# EAGLE schematic MotherBoard (EAGLE 5.01)

## Sheet 1 of 18
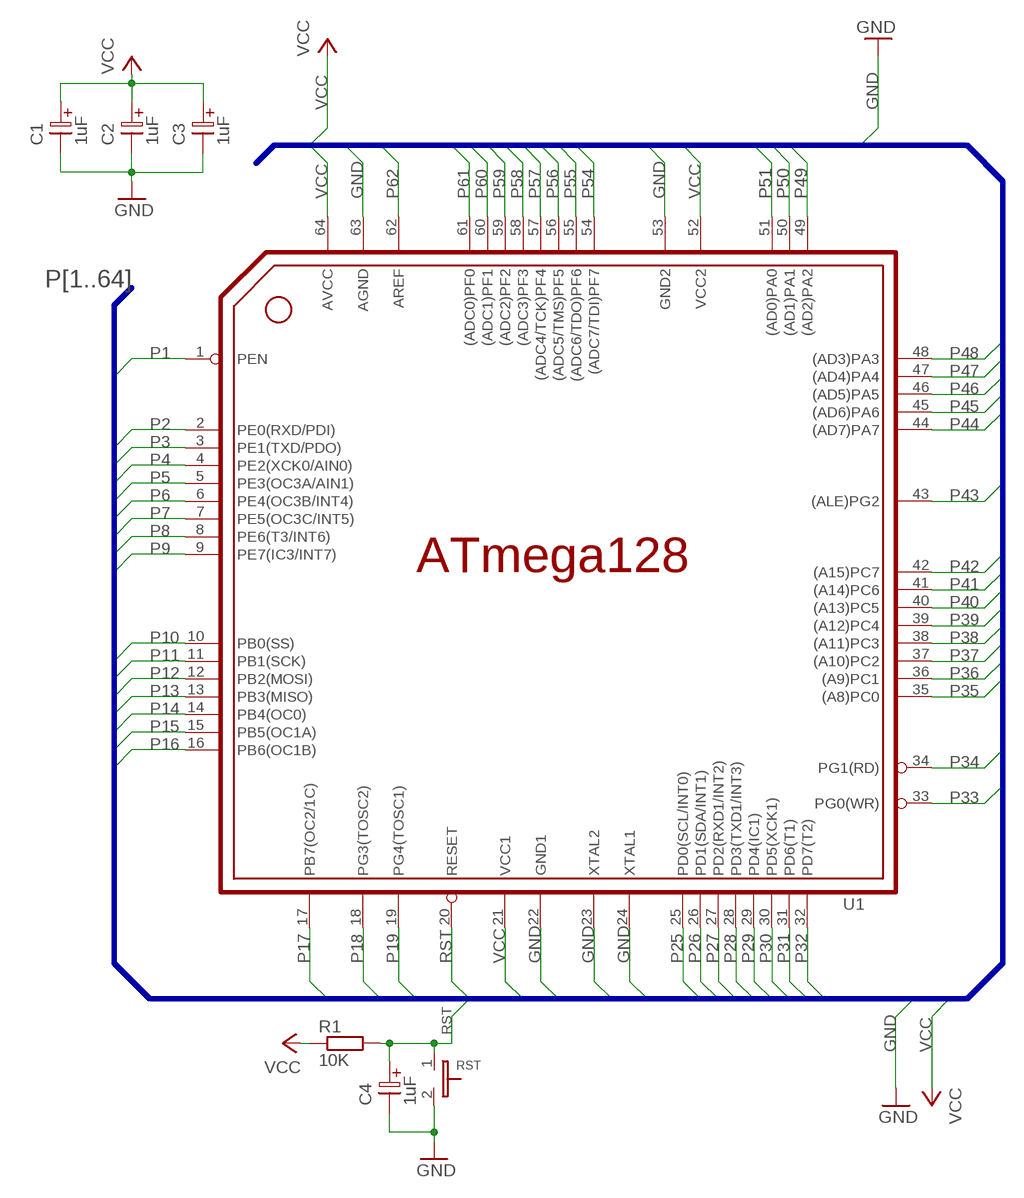
[diagram p0: schematic, sheet 1]

### Parts
C1  1uF  ELC2.5  [ELC2.5]
C2  1uF  ELC2.5  [ELC2.5]
C3  1uF  ELC2.5  [ELC2.5]
C4  1uF  ELC2.5  [ELC2.5]
R1  10K  R-5-10M  [R-10]
RST  TAC_SW_S  [SW]
U1  ATMEGA128_HOLDERH  [HEADER64PIN]

### Nets
GND: C1.2 C2.2 C3.2 C4.2 RST.2 U1.22(GND1) U1.23(XTAL2) U1.24(XTAL1) U1.53(GND2) U1.63(AGND) ; also sheet 2,3,4,5,6,7,8,10,11,12,13,14,15,16,17,18
P1: U1.1(PEN)
P2: U1.2(PE0(RXD/PDI)) ; also sheet 4,6,11,12
P3: U1.3(PE1(TXD/PDO)) ; also sheet 4,6,11,12
P4: U1.4(PE2(XCK0/AIN0)) ; also sheet 4,6,11,12
P5: U1.5(PE3(OC3A/AIN1)) ; also sheet 4,6,12,18
P6: U1.6(PE4(OC3B/INT4)) ; also sheet 4,5,12
P7: U1.7(PE5(OC3C/INT5)) ; also sheet 4,5,12
P8: U1.8(PE6(T3/INT6)) ; also sheet 4,5,12
P9: U1.9(PE7(IC3/INT7)) ; also sheet 4,5,12
P10: U1.10(PB0(SS)) ; also sheet 4,5,16
P11: U1.11(PB1(SCK)) ; also sheet 3,4,5,16
P12: U1.12(PB2(MOSI)) ; also sheet 3,4,5,16
P13: U1.13(PB3(MISO)) ; also sheet 3,4,5,16
P14: U1.14(PB4(OC0)) ; also sheet 4,5,13
P15: U1.15(PB5(OC1A)) ; also sheet 4,5,15
P16: U1.16(PB6(OC1B)) ; also sheet 4,5,18
P17: U1.17(PB7(OC2/1C)) ; also sheet 4,5,15
P18: U1.18(PG3(TOSC2))
P19: U1.19(PG4(TOSC1))
P25: U1.25(PD0(SCL/INT0)) ; also sheet 4,5,8,16
P26: U1.26(PD1(SDA/INT1)) ; also sheet 4,5,8
P27: U1.27(PD2(RXD1/INT2)) ; also sheet 4,5,6,8
P28: U1.28(PD3(TXD1/INT3)) ; also sheet 4,5,6,8
P29: U1.29(PD4(IC1)) ; also sheet 4,18
P30: U1.30(PD5(XCK1)) ; also sheet 4,18
P31: U1.31(PD6(T1)) ; also sheet 4,18
P32: U1.32(PD7(T2)) ; also sheet 4,18
P33: U1.33(PG0(WR)) ; also sheet 10,17
P34: U1.34(PG1(RD)) ; also sheet 10,17
P35: U1.35((A8)PC0) ; also sheet 4,10,13
P36: U1.36((A9)PC1) ; also sheet 4,10
P37: U1.37((A10)PC2) ; also sheet 4,7,10
P38: U1.38((A11)PC3) ; also sheet 4,7,10
P39: U1.39((A12)PC4) ; also sheet 4,7,9,10
P40: U1.40((A13)PC5) ; also sheet 4,7,9,10
P41: U1.41((A14)PC6) ; also sheet 4,7,9,10
P42: U1.42((A15)PC7) ; also sheet 4,7,9,10
P43: U1.43((ALE)PG2) ; also sheet 13,16
P44: U1.44((AD7)PA7) ; also sheet 4,7,9
P45: U1.45((AD6)PA6) ; also sheet 4,7,9
P46: U1.46((AD5)PA5) ; also sheet 4,7,9
P47: U1.47((AD4)PA4) ; also sheet 4,7,9,17
P48: U1.48((AD3)PA3) ; also sheet 4,7,9,17
P49: U1.49((AD2)PA2) ; also sheet 4,7,9,17
P50: U1.50((AD1)PA1) ; also sheet 4,6,7,9
P51: U1.51((AD0)PA0) ; also sheet 4,6,7,9
P54: U1.54((ADC7/TDI)PF7) ; also sheet 4,13
P55: U1.55((ADC6/TDO)PF6) ; also sheet 4,13
P56: U1.56((ADC5/TMS)PF5) ; also sheet 4,13
P57: U1.57((ADC4/TCK)PF4) ; also sheet 4,13
P58: U1.58((ADC3)PF3) ; also sheet 4,13
P59: U1.59((ADC2)PF2) ; also sheet 4,13
P60: U1.60((ADC1)PF1) ; also sheet 4,13
P61: U1.61((ADC0)PF0) ; also sheet 4,13
P62: U1.62(AREF) ; also sheet 13
RST: C4.1 R1.2 RST.1 U1.20(RESET) ; also sheet 3
VCC: C1.1 C2.1 C3.1 R1.1 U1.21(VCC1) U1.52(VCC2) U1.64(AVCC) ; also sheet 2,3,4,5,6,7,8,9,10,11,12,13,14,15,16,17,18

### Buses
P[1..64]

## Sheet 2 of 18
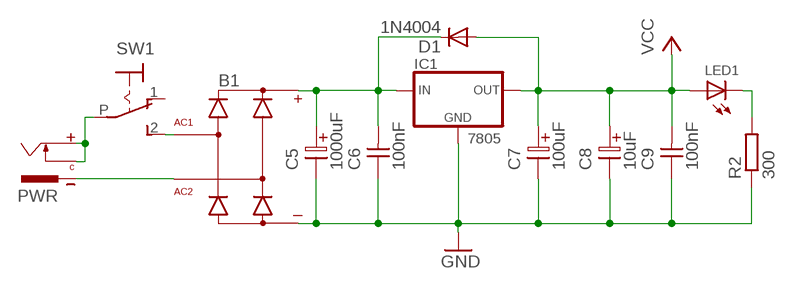
[diagram p1: schematic, sheet 2]

### Parts
B1  RB1A  [RB1A]
C5  1000uF  ELC5  [ELC5]
C6  100nF  CAP2.5  [CAP2.5]
C7  100uF  ELC2.5  [ELC2.5]
C8  10uF  ELC2.5  [ELC2.5]
C9  100nF  CAP2.5  [CAP2.5]
D1  1N4004  [DO41-10]
IC1  7805  78XXL  [78XXL]
LED1  LED3  [LED3MM]
PWR  DC-JACK.  [PW]
R2  300  RESISTOR-7M  [R-7]
SW1  POWER_SWSW  [SWITCH]

### Nets
GND: B1.- C5.2 C6.1 C7.2 C8.2 C9.1 IC1.GND R2.1 ; also sheet 1,3,4,5,6,7,8,10,11,12,13,14,15,16,17,18
N$2: B1.AC2 PWR.-
N$3: B1.+ C5.1 C6.2 D1.C IC1.IN
N$4: LED1.K(C) R2.2
N$189: B1.AC1 SW1.2
N$192: PWR.+ PWR.C SW1.P
VCC: C7.1 C8.1 C9.2 D1.A IC1.OUT LED1.A ; also sheet 1,3,4,5,6,7,8,9,10,11,12,13,14,15,16,17,18
Unconnected: SW1.1

## Sheet 3 of 18
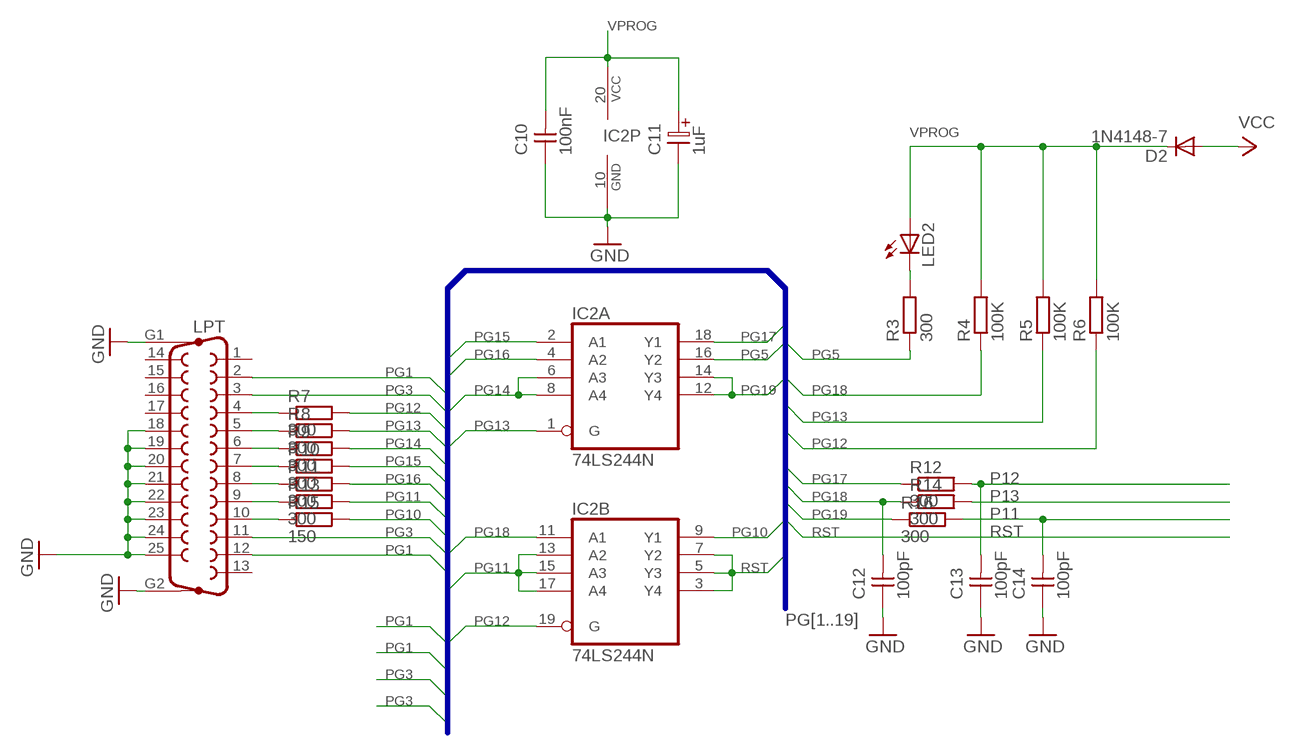
[diagram p2: schematic, sheet 3]

### Parts
C10  100nF  CAP2.5  [CAP2.5]
C11  1uF  ELC2.5  [ELC2.5]
C12  100pF  CAP2.5  [CAP2.5]
C13  100pF  CAP2.5  [CAP2.5]
C14  100pF  CAP2.5  [CAP2.5]
D2  1N4148-7  [DO35-7]
IC2  74LS244N  [DIL20]
LED2  LED3MM  [LED3MM]
LPT  F25HP  [F25HP]
R3  300  R-5-10M  [R-10]
R4  100K  R-5-10M  [R-10]
R5  100K  R-5-10M  [R-10]
R6  100K  R-5-10M  [R-10]
R7  300  R-5-10M  [R-10]
R8  300  R-5-10M  [R-10]
R9  300  R-5-10M  [R-10]
R10  300  R-5-10M  [R-10]
R11  300  R-5-10M  [R-10]
R12  300  R-5-10M  [R-10]
R13  300  R-5-10M  [R-10]
R14  300  R-5-10M  [R-10]
R15  150  R-5-10M  [R-10]
R16  300  R-5-10M  [R-10]

### Nets
GND: C10.1 C11.2 C12.1 C13.1 C14.1 IC2.10(P:GND) LPT.18 LPT.19 LPT.20 LPT.21 LPT.22 LPT.23 LPT.24 LPT.25 LPT.G1 LPT.G2 ; also sheet 1,2,4,5,6,7,8,10,11,12,13,14,15,16,17,18
N$5: LED2.K(C) R3.2
N$265: LPT.4 R7.1
N$266: LPT.5 R8.1
N$278: LPT.6 R9.1
N$279: LPT.7 R10.1
N$280: LPT.8 R11.1
N$281: LPT.9 R13.1
N$282: LPT.10 R15.1
P11: C14.2 R16.2 ; also sheet 1,4,5,16
P12: C13.2 R12.2 ; also sheet 1,4,5,16
P13: R14.2 ; also sheet 1,4,5,16
PG1: LPT.2 LPT.12
PG3: LPT.3 LPT.11
PG5: IC2.16(A:Y2) R3.1
PG10: IC2.9(B:Y1) R15.2
PG11: IC2.13(B:A2) IC2.15(B:A3) IC2.17(B:A4) R13.2
PG12: IC2.19(B:G) R6.1 R7.2
PG13: IC2.1(A:G) R5.1 R8.2
PG14: IC2.6(A:A3) IC2.8(A:A4) R9.2
PG15: IC2.2(A:A1) R10.2
PG16: IC2.4(A:A2) R11.2
PG17: IC2.18(A:Y1) R12.1
PG18: C12.2 IC2.11(B:A1) R4.1 R14.1
PG19: IC2.12(A:Y4) IC2.14(A:Y3) R16.1
RST: IC2.3(B:Y4) IC2.5(B:Y3) IC2.7(B:Y2) ; also sheet 1
VCC: D2.A ; also sheet 1,2,4,5,6,7,8,9,10,11,12,13,14,15,16,17,18
VPROG: C10.2 C11.1 D2.C IC2.20(P:VCC) LED2.A R4.2 R5.2 R6.2
Unconnected: LPT.1 LPT.13 LPT.14 LPT.15 LPT.16 LPT.17

### Buses
PG[1..19]

## Sheet 4 of 18
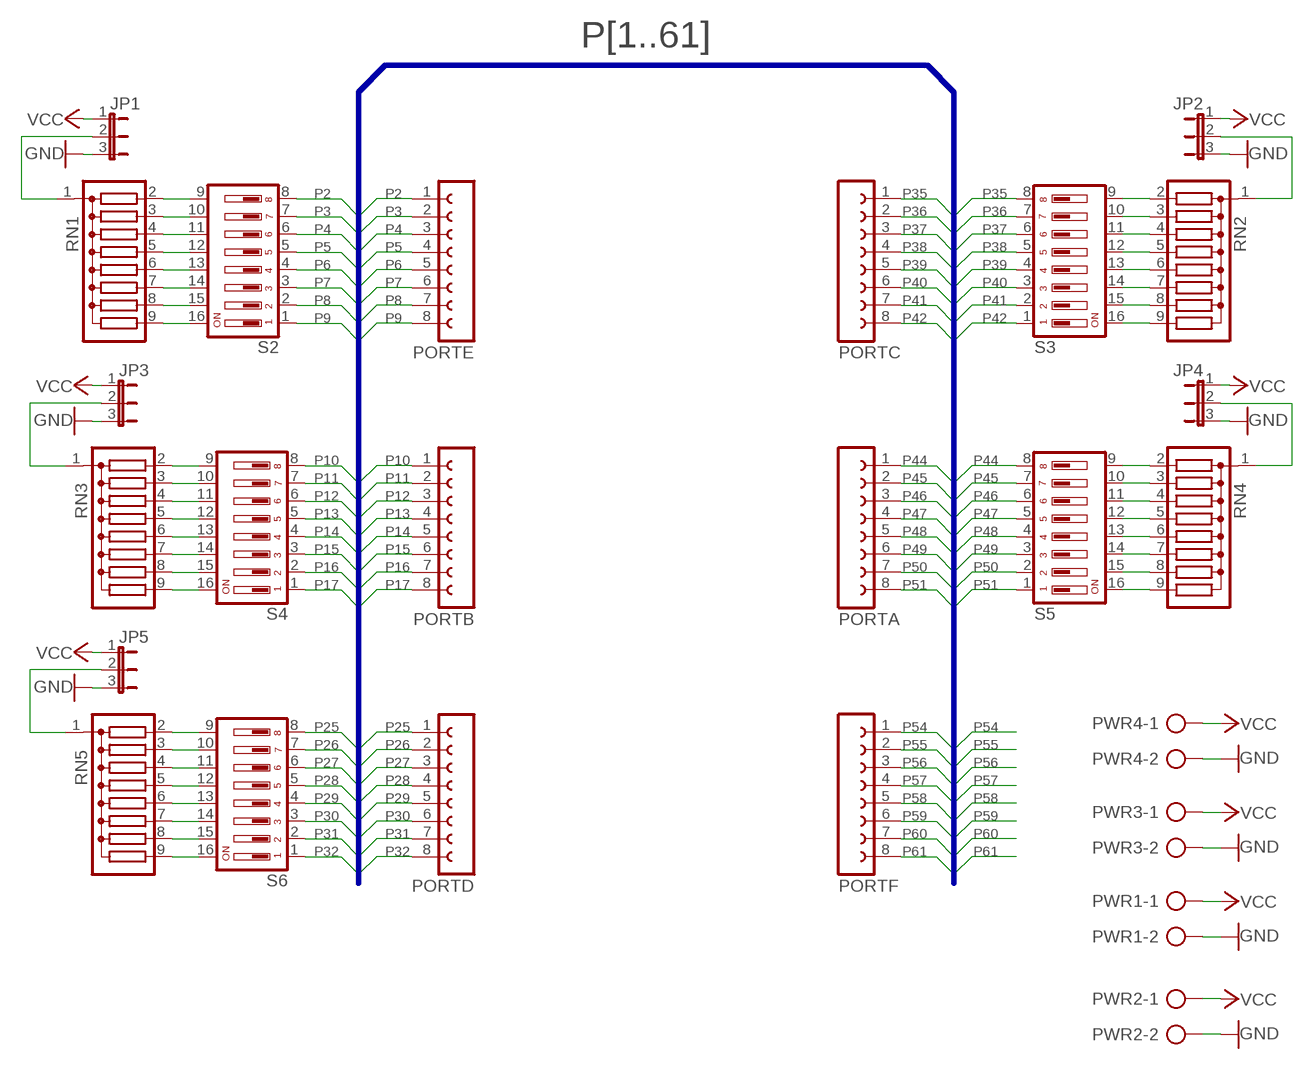
[diagram p3: schematic, sheet 4]

### Parts
JP1  JP2E  [JP2]
JP2  JP2E  [JP2]
JP3  JP2E  [JP2]
JP4  JP2E  [JP2]
JP5  JP2E  [JP2]
PORTA  FE08-1  [FE08]
PORTB  FE08-1  [FE08]
PORTC  FE08-1  [FE08]
PORTD  FE08-1  [FE08]
PORTE  FE08-1  [FE08]
PORTF  FE08-1  [FE08]
PWR1  AK500/2  [AK500/2]
PWR2  AK500/2  [AK500/2]
PWR3  AK500/2  [AK500/2]
PWR4  AK500/2  [AK500/2]
RN1  G08R  [SIL9]
RN2  G08R  [SIL9]
RN3  G08R  [SIL9]
RN4  G08R  [SIL9]
RN5  G08R  [SIL9]
S2  DIP08YL  [DIP08YL]
S3  DIP08YL  [DIP08YL]
S4  DIP08YL  [DIP08YL]
S5  DIP08YL  [DIP08YL]
S6  DIP08YL  [DIP08YL]

### Nets
GND: JP1.3 JP2.3 JP3.3 JP4.3 JP5.3 PWR1.2 PWR2.2 PWR3.2 PWR4.2 ; also sheet 1,2,3,5,6,7,8,10,11,12,13,14,15,16,17,18
N$6: JP1.2 RN1.1
N$7: JP3.2 RN3.1
N$8: RN3.2 S4.9
N$12: RN1.2 S2.9
N$13: RN1.3 S2.10
N$14: RN1.4 S2.11
N$15: RN1.5 S2.12
N$16: RN1.6 S2.13
N$17: RN1.7 S2.14
N$18: RN1.8 S2.15
N$19: RN1.9 S2.16
N$20: RN3.3 S4.10
N$21: RN3.4 S4.11
N$22: RN3.5 S4.12
N$23: RN3.6 S4.13
N$24: RN3.7 S4.14
N$25: RN3.8 S4.15
N$26: RN3.9 S4.16
N$27: JP5.2 RN5.1
N$28: RN5.2 S6.9
N$29: RN5.3 S6.10
N$30: RN5.4 S6.11
N$31: RN5.5 S6.12
N$32: RN5.6 S6.13
N$33: RN5.7 S6.14
N$34: RN5.8 S6.15
N$35: RN5.9 S6.16
N$42: JP4.2 RN4.1
N$43: RN4.2 S5.9
N$44: RN4.3 S5.10
N$45: RN4.4 S5.11
N$46: RN4.5 S5.12
N$47: RN4.6 S5.13
N$48: RN4.7 S5.14
N$49: RN4.8 S5.15
N$50: RN4.9 S5.16
N$51: JP2.2 RN2.1
N$52: RN2.2 S3.9
N$53: RN2.3 S3.10
N$54: RN2.4 S3.11
N$55: RN2.5 S3.12
N$56: RN2.6 S3.13
N$57: RN2.7 S3.14
N$58: RN2.8 S3.15
N$59: RN2.9 S3.16
P2: PORTE.1 S2.8 ; also sheet 1,6,11,12
P3: PORTE.2 S2.7 ; also sheet 1,6,11,12
P4: PORTE.3 S2.6 ; also sheet 1,6,11,12
P5: PORTE.4 S2.5 ; also sheet 1,6,12,18
P6: PORTE.5 S2.4 ; also sheet 1,5,12
P7: PORTE.6 S2.3 ; also sheet 1,5,12
P8: PORTE.7 S2.2 ; also sheet 1,5,12
P9: PORTE.8 S2.1 ; also sheet 1,5,12
P10: PORTB.1 S4.8 ; also sheet 1,5,16
P11: PORTB.2 S4.7 ; also sheet 1,3,5,16
P12: PORTB.3 S4.6 ; also sheet 1,3,5,16
P13: PORTB.4 S4.5 ; also sheet 1,3,5,16
P14: PORTB.5 S4.4 ; also sheet 1,5,13
P15: PORTB.6 S4.3 ; also sheet 1,5,15
P16: PORTB.7 S4.2 ; also sheet 1,5,18
P17: PORTB.8 S4.1 ; also sheet 1,5,15
P25: PORTD.1 S6.8 ; also sheet 1,5,8,16
P26: PORTD.2 S6.7 ; also sheet 1,5,8
P27: PORTD.3 S6.6 ; also sheet 1,5,6,8
P28: PORTD.4 S6.5 ; also sheet 1,5,6,8
P29: PORTD.5 S6.4 ; also sheet 1,18
P30: PORTD.6 S6.3 ; also sheet 1,18
P31: PORTD.7 S6.2 ; also sheet 1,18
P32: PORTD.8 S6.1 ; also sheet 1,18
P35: PORTC.1 S3.8 ; also sheet 1,10,13
P36: PORTC.2 S3.7 ; also sheet 1,10
P37: PORTC.3 S3.6 ; also sheet 1,7,10
P38: PORTC.4 S3.5 ; also sheet 1,7,10
P39: PORTC.5 S3.4 ; also sheet 1,7,9,10
P40: PORTC.6 S3.3 ; also sheet 1,7,9,10
P41: PORTC.7 S3.2 ; also sheet 1,7,9,10
P42: PORTC.8 S3.1 ; also sheet 1,7,9,10
P44: PORTA.1 S5.8 ; also sheet 1,7,9
P45: PORTA.2 S5.7 ; also sheet 1,7,9
P46: PORTA.3 S5.6 ; also sheet 1,7,9
P47: PORTA.4 S5.5 ; also sheet 1,7,9,17
P48: PORTA.5 S5.4 ; also sheet 1,7,9,17
P49: PORTA.6 S5.3 ; also sheet 1,7,9,17
P50: PORTA.7 S5.2 ; also sheet 1,6,7,9
P51: PORTA.8 S5.1 ; also sheet 1,6,7,9
P54: PORTF.1 ; also sheet 1,13
P55: PORTF.2 ; also sheet 1,13
P56: PORTF.3 ; also sheet 1,13
P57: PORTF.4 ; also sheet 1,13
P58: PORTF.5 ; also sheet 1,13
P59: PORTF.6 ; also sheet 1,13
P60: PORTF.7 ; also sheet 1,13
P61: PORTF.8 ; also sheet 1,13
VCC: JP1.1 JP2.1 JP3.1 JP4.1 JP5.1 PWR1.1 PWR2.1 PWR3.1 PWR4.1 ; also sheet 1,2,3,5,6,7,8,9,10,11,12,13,14,15,16,17,18

### Buses
P[1..61]

## Sheet 5 of 18
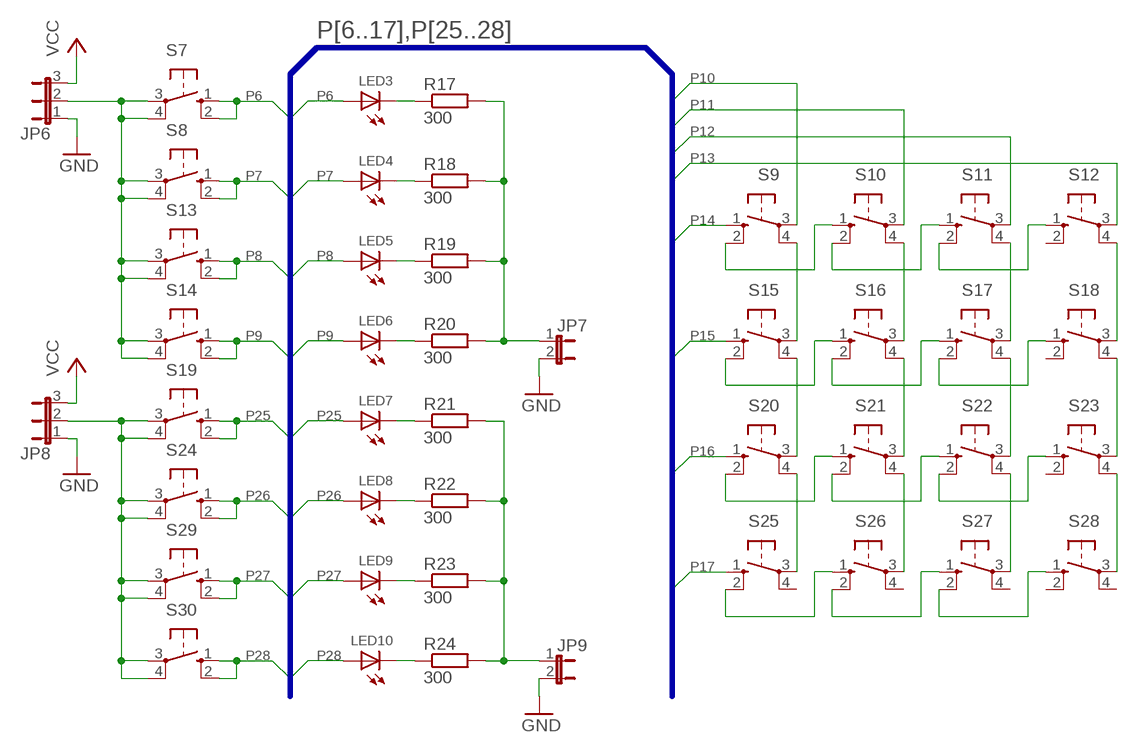
[diagram p4: schematic, sheet 5]

### Parts
JP6  JP2E  [JP2]
JP7  JP1EY  [JP1Y]
JP8  JP2E  [JP2]
JP9  JP1EY  [JP1Y]
LED3  LED5  [LED5MM]
LED4  LED5  [LED5MM]
LED5  LED5  [LED5MM]
LED6  LED5  [LED5MM]
LED7  LED5  [LED5MM]
LED8  LED5  [LED5MM]
LED9  LED5  [LED5MM]
LED10  LED5  [LED5MM]
R17  300  RESISTOR-10M  [R-10]
R18  300  RESISTOR-10M  [R-10]
R19  300  RESISTOR-10M  [R-10]
R20  300  RESISTOR-10M  [R-10]
R21  300  RESISTOR-8M  [R-8]
R22  300  RESISTOR-8M  [R-8]
R23  300  RESISTOR-8M  [R-8]
R24  300  RESISTOR-8M  [R-8]
S7  10-XX  [B3F-10XX]
S8  10-XX  [B3F-10XX]
S9  TAC_SW_B  [B3F-40XX]
S10  TAC_SW_B  [B3F-40XX]
S11  TAC_SW_B  [B3F-40XX]
S12  TAC_SW_B  [B3F-40XX]
S13  10-XX  [B3F-10XX]
S14  10-XX  [B3F-10XX]
S15  TAC_SW_B  [B3F-40XX]
S16  TAC_SW_B  [B3F-40XX]
S17  TAC_SW_B  [B3F-40XX]
S18  TAC_SW_B  [B3F-40XX]
S19  10-XX  [B3F-10XX]
S20  TAC_SW_B  [B3F-40XX]
S21  TAC_SW_B  [B3F-40XX]
S22  TAC_SW_B  [B3F-40XX]
S23  TAC_SW_B  [B3F-40XX]
S24  10-XX  [B3F-10XX]
S25  TAC_SW_B  [B3F-40XX]
S26  TAC_SW_B  [B3F-40XX]
S27  TAC_SW_B  [B3F-40XX]
S28  TAC_SW_B  [B3F-40XX]
S29  10-XX  [B3F-10XX]
S30  10-XX  [B3F-10XX]

### Nets
GND: JP6.1 JP7.2 JP8.1 JP9.2 ; also sheet 1,2,3,4,6,7,8,10,11,12,13,14,15,16,17,18
N$9: JP6.2 S7.3(P) S7.4(P1) S8.3(P) S8.4(P1) S13.3(P) S13.4(P1) S14.3(P) S14.4(P1)
N$11: JP8.2 S19.3(P) S19.4(P1) S24.3(P) S24.4(P1) S29.3(P) S29.4(P1) S30.3(P) S30.4(P1)
N$36: S9.2(S1) S10.1(S)
N$37: S10.2(S1) S11.1(S)
N$38: S11.2(S1) S12.1(S)
N$39: S20.2(S1) S21.1(S)
N$40: S21.2(S1) S22.1(S)
N$41: S22.2(S1) S23.1(S)
N$60: S15.2(S1) S16.1(S)
N$61: S16.2(S1) S17.1(S)
N$62: S17.2(S1) S18.1(S)
N$65: S25.2(S1) S26.1(S)
N$66: S26.2(S1) S27.1(S)
N$67: S9.4(P1) S15.3(P)
N$68: S10.4(P1) S16.3(P)
N$69: S11.4(P1) S17.3(P)
N$70: S12.4(P1) S18.3(P)
N$71: S27.2(S1) S28.1(S)
N$73: S20.4(P1) S25.3(P)
N$74: S21.4(P1) S26.3(P)
N$75: S22.4(P1) S27.3(P)
N$76: S23.4(P1) S28.3(P)
N$77: S15.4(P1) S20.3(P)
N$78: S16.4(P1) S21.3(P)
N$79: S17.4(P1) S22.3(P)
N$80: S18.4(P1) S23.3(P)
N$138: LED3.K(C) R17.1
N$139: LED5.K(C) R19.1
N$140: LED6.K(C) R20.1
N$141: LED7.K(C) R21.1
N$142: LED8.K(C) R22.1
N$143: LED9.K(C) R23.1
N$144: LED10.K(C) R24.1
N$145: LED4.K(C) R18.1
N$276: JP7.1 R17.2 R18.2 R19.2 R20.2
N$277: JP9.1 R21.2 R22.2 R23.2 R24.2
P6: LED3.A S7.1(S) S7.2(S1) ; also sheet 1,4,12
P7: LED4.A S8.1(S) S8.2(S1) ; also sheet 1,4,12
P8: LED5.A S13.1(S) S13.2(S1) ; also sheet 1,4,12
P9: LED6.A S14.1(S) S14.2(S1) ; also sheet 1,4,12
P10: S9.3(P) ; also sheet 1,4,16
P11: S10.3(P) ; also sheet 1,3,4,16
P12: S11.3(P) ; also sheet 1,3,4,16
P13: S12.3(P) ; also sheet 1,3,4,16
P14: S9.1(S) ; also sheet 1,4,13
P15: S15.1(S) ; also sheet 1,4,15
P16: S20.1(S) ; also sheet 1,4,18
P17: S25.1(S) ; also sheet 1,4,15
P25: LED7.A S19.1(S) S19.2(S1) ; also sheet 1,4,8,16
P26: LED8.A S24.1(S) S24.2(S1) ; also sheet 1,4,8
P27: LED9.A S29.1(S) S29.2(S1) ; also sheet 1,4,6,8
P28: LED10.A S30.1(S) S30.2(S1) ; also sheet 1,4,6,8
VCC: JP6.3 JP8.3 ; also sheet 1,2,3,4,6,7,8,9,10,11,12,13,14,15,16,17,18
Unconnected: S12.2(S1) S18.2(S1) S23.2(S1) S25.4(P1) S26.4(P1) S27.4(P1) S28.2(S1) S28.4(P1)

### Buses
P[6..17],P[25..28]

## Sheet 6 of 18
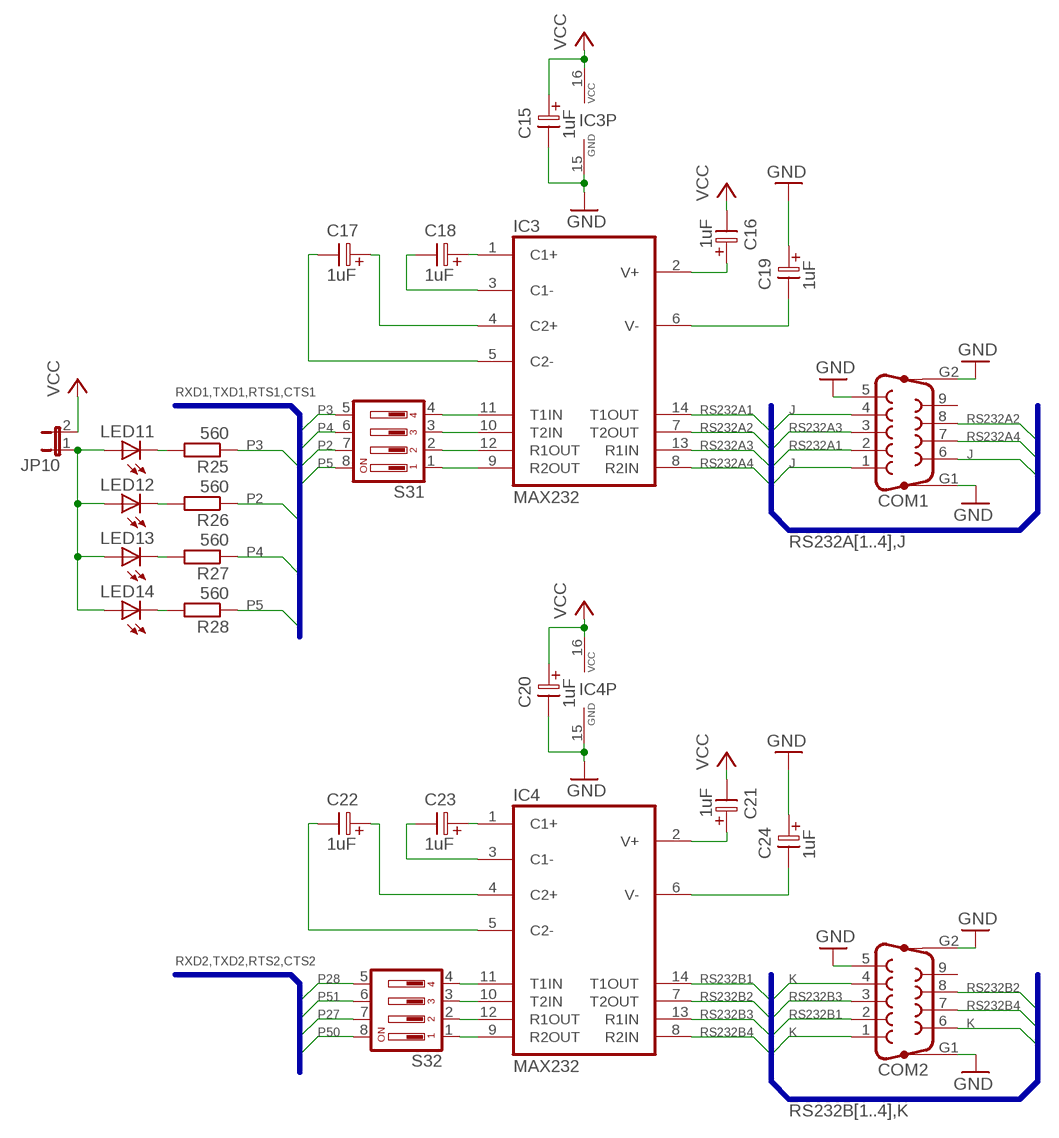
[diagram p5: schematic, sheet 6]

### Parts
C15  1uF  ELC2.5  [ELC2.5]
C16  1uF  ELC2.5  [ELC2.5]
C17  1uF  ELC2.5  [ELC2.5]
C18  1uF  ELC2.5  [ELC2.5]
C19  1uF  ELC2.5  [ELC2.5]
C20  1uF  ELC2.5  [ELC2.5]
C21  1uF  ELC2.5  [ELC2.5]
C22  1uF  ELC2.5  [ELC2.5]
C23  1uF  ELC2.5  [ELC2.5]
C24  1uF  ELC2.5  [ELC2.5]
COM1  F09HP  [F09HP]
COM2  F09HP  [F09HP]
IC3  MAX232  [DIL16L]
IC4  MAX232  [DIL16L]
JP10  JP1EY  [JP1Y]
LED11  LED3MM  [LED3MM]
LED12  LED3MM  [LED3MM]
LED13  LED3MM  [LED3MM]
LED14  LED3MM  [LED3MM]
R25  560  R-5-10M  [R-10]
R26  560  R-5-10M  [R-10]
R27  560  R-5-10M  [R-10]
R28  560  R-5-10M  [R-10]
S31  DIP04YL  [DIP04YL]
S32  DIP04YL  [DIP04YL]

### Nets
GND: C15.2 C19.1 C20.2 C24.1 COM1.5 COM1.G1 COM1.G2 COM2.5 COM2.G1 COM2.G2 IC3.15(GND) IC4.15(GND) ; also sheet 1,2,3,4,5,7,8,10,11,12,13,14,15,16,17,18
J: COM1.1 COM1.4 COM1.6
K: COM2.1 COM2.4 COM2.6
N$10: C18.1 IC3.1(C1+)
N$63: C18.2 IC3.3(C1-)
N$64: C17.1 IC3.4(C2+)
N$72: C17.2 IC3.5(C2-)
N$81: C19.2 IC3.6(V-)
N$82: C16.1 IC3.2(V+)
N$83: IC3.9(R2OUT) S31.1
N$84: IC3.12(R1OUT) S31.2
N$85: IC3.10(T2IN) S31.3
N$86: IC3.11(T1IN) S31.4
N$87: C23.1 IC4.1(C1+)
N$88: C23.2 IC4.3(C1-)
N$89: C22.1 IC4.4(C2+)
N$90: C22.2 IC4.5(C2-)
N$91: C24.2 IC4.6(V-)
N$92: C21.1 IC4.2(V+)
N$93: IC4.9(R2OUT) S32.1
N$94: IC4.12(R1OUT) S32.2
N$95: IC4.10(T2IN) S32.3
N$96: IC4.11(T1IN) S32.4
N$97: LED11.K(C) R25.2
N$230: JP10.1 LED11.A LED12.A LED13.A LED14.A
N$269: LED12.K(C) R26.2
N$270: LED13.K(C) R27.2
N$271: LED14.K(C) R28.2
P2: R26.1 S31.7 ; also sheet 1,4,11,12
P3: R25.1 S31.5 ; also sheet 1,4,11,12
P4: R27.1 S31.6 ; also sheet 1,4,11,12
P5: R28.1 S31.8 ; also sheet 1,4,12,18
P27: S32.7 ; also sheet 1,4,5,8
P28: S32.5 ; also sheet 1,4,5,8
P50: S32.8 ; also sheet 1,4,7,9
P51: S32.6 ; also sheet 1,4,7,9
RS232A1: COM1.2 IC3.14(T1OUT)
RS232A2: COM1.8 IC3.7(T2OUT)
RS232A3: COM1.3 IC3.13(R1IN)
RS232A4: COM1.7 IC3.8(R2IN)
RS232B1: COM2.2 IC4.14(T1OUT)
RS232B2: COM2.8 IC4.7(T2OUT)
RS232B3: COM2.3 IC4.13(R1IN)
RS232B4: COM2.7 IC4.8(R2IN)
VCC: C15.1 C16.2 C20.1 C21.2 IC3.16(VCC) IC4.16(VCC) JP10.2 ; also sheet 1,2,3,4,5,7,8,9,10,11,12,13,14,15,16,17,18
Unconnected: COM1.9 COM2.9

### Buses
RS232A[1..4],J
RXD1,TXD1,RTS1,CTS1
RS232B[1..4],K
RXD2,TXD2,RTS2,CTS2

## Sheet 7 of 18
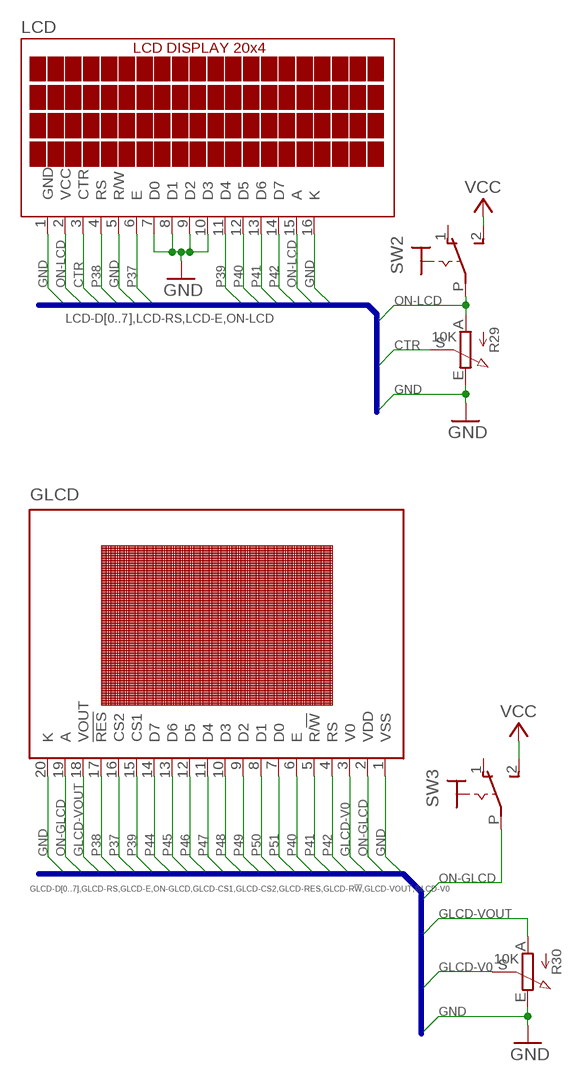
[diagram p6: schematic, sheet 7]

### Parts
GLCD  LCD128X64  [LCD128X64]
LCD  LCD20X4  [LCD20X4]
R29  10K  POT  [POT]
R30  10K  POT  [POT]
SW2  POWER_SW3  [ON_OFF]
SW3  POWER_SW3  [ON_OFF]

### Nets
CTR: LCD.3(CTR) R29.S
GLCD-V0: GLCD.3(V0) R30.S
GLCD-VOUT: GLCD.18(VOUT) R30.A
GND: GLCD.1(VSS) GLCD.20(K) LCD.1(GND) LCD.5(R/W) LCD.7(D0) LCD.8(D1) LCD.9(D2) LCD.10(D3) LCD.16(K) R29.E R30.E ; also sheet 1,2,3,4,5,6,8,10,11,12,13,14,15,16,17,18
ON-GLCD: GLCD.2(VDD) GLCD.19(A) SW3.P
ON-LCD: LCD.2(VCC) LCD.15(A) R29.A SW2.P
P37: GLCD.16(CS2) LCD.6(E) ; also sheet 1,4,10
P38: GLCD.17(!RES) LCD.4(RS) ; also sheet 1,4,10
P39: GLCD.15(CS1) LCD.11(D4) ; also sheet 1,4,9,10
P40: GLCD.6(E) LCD.12(D5) ; also sheet 1,4,9,10
P41: GLCD.5(R/!W) LCD.13(D6) ; also sheet 1,4,9,10
P42: GLCD.4(RS) LCD.14(D7) ; also sheet 1,4,9,10
P44: GLCD.14(D7) ; also sheet 1,4,9
P45: GLCD.13(D6) ; also sheet 1,4,9
P46: GLCD.12(D5) ; also sheet 1,4,9
P47: GLCD.11(D4) ; also sheet 1,4,9,17
P48: GLCD.10(D3) ; also sheet 1,4,9,17
P49: GLCD.9(D2) ; also sheet 1,4,9,17
P50: GLCD.8(D1) ; also sheet 1,4,6,9
P51: GLCD.7(D0) ; also sheet 1,4,6,9
VCC: SW2.2 SW3.2 ; also sheet 1,2,3,4,5,6,8,9,10,11,12,13,14,15,16,17,18
Unconnected: SW2.1 SW3.1

### Buses
LCD-D[0..7],LCD-RS,LCD-E,ON-LCD
GLCD-D[0..7],GLCD-RS,GLCD-E,ON-GLCD,GLCD-CS1,GLCD-CS2,GLCD-RES,GLCD-R!W,GLCD-VOUT,GLCD-V0

## Sheet 8 of 18
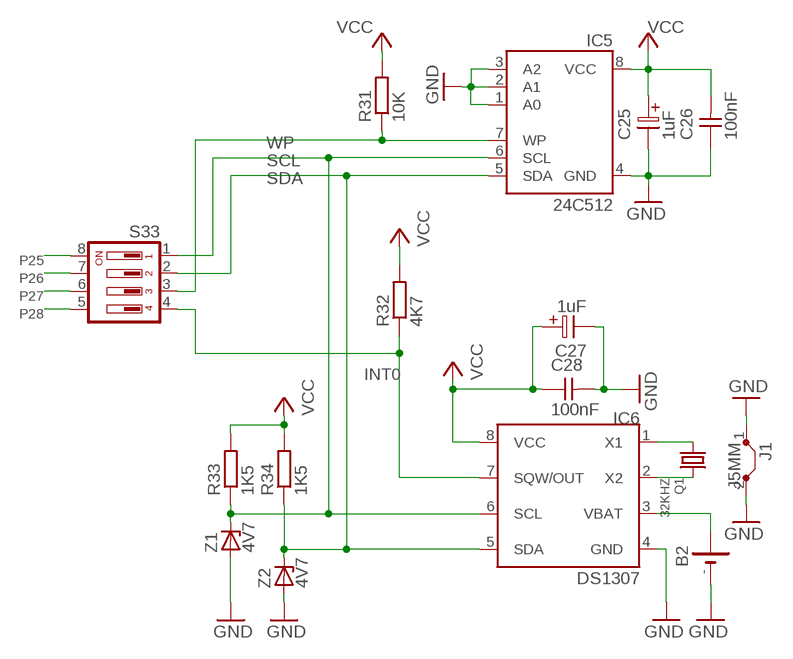
[diagram p7: schematic, sheet 8]

### Parts
B2  BATTB  [BATT]
C25  1uF  ELC2.5  [ELC2.5]
C26  100nF  CAP2.5  [CAP2.5]
C27  1uF  ELC2.5  [ELC2.5]
C28  100nF  CAP2.5  [CAP2.5]
IC5  24C512  AT24CP  [DIL8L]
IC6  DS1307  DS1307L  [DIL8L]
J1  J5MM  [05]
Q1  32KHZ  CRYSTALTC  [TC26]
R31  10K  RESISTOR-10M  [R-10]
R32  4K7  RESISTOR-10M  [R-10]
R33  1K5  RESISTOR-10M  [R-10]
R34  1K5  RESISTOR-10M  [R-10]
S33  DIP04YL  [DIP04YL]
Z1  4V7  ZENER7  [DO35-7B]
Z2  4V7  ZENER7  [DO35-7B]

### Nets
GND: B2.- C25.2 C26.1 C27.2 C28.2 IC5.1(A0) IC5.2(A1) IC5.3(A2) IC5.4(GND) IC6.4(GND) J1.1 J1.2 Z1.A Z2.A ; also sheet 1,2,3,4,5,6,7,10,11,12,13,14,15,16,17,18
INT0: IC6.7(SQW/OUT) R32.1 S33.4
N$131: IC6.2(X2) Q1.2
N$132: IC6.1(X1) Q1.1
P25: S33.8 ; also sheet 1,4,5,16
P26: S33.7 ; also sheet 1,4,5
P27: S33.6 ; also sheet 1,4,5,6
P28: S33.5 ; also sheet 1,4,5,6
SCL: IC5.6(SCL) IC6.6(SCL) R33.1 S33.1 Z1.C
SDA: IC5.5(SDA) IC6.5(SDA) R34.1 S33.2 Z2.C
VBAT1: B2.+ IC6.3(VBAT)
VCC: C25.1 C26.2 C27.1 C28.1 IC5.8(VCC) IC6.8(VCC) R31.2 R32.2 R33.2 R34.2 ; also sheet 1,2,3,4,5,6,7,9,10,11,12,13,14,15,16,17,18
WP: IC5.7(WP) R31.1 S33.3

## Sheet 9 of 18
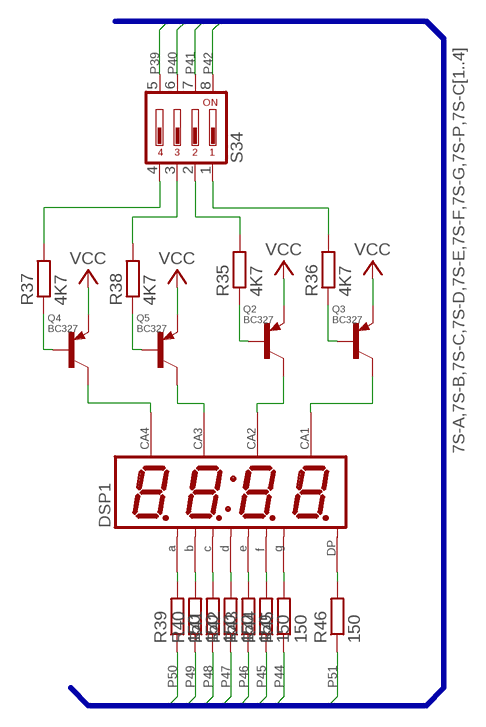
[diagram p8: schematic, sheet 9]

### Parts
DSP1  DISPLAY-Q0.56'  [DISPLAY-Q0.56]
Q2  BC327  BC327L  [TO92L]
Q3  BC327  BC327L  [TO92L]
Q4  BC327  BC327L  [TO92L]
Q5  BC327  BC327L  [TO92L]
R35  4K7  RESISTOR-10M  [R-10]
R36  4K7  RESISTOR-10M  [R-10]
R37  4K7  RESISTOR-10M  [R-10]
R38  4K7  RESISTOR-10M  [R-10]
R39  150  RESISTOR-10M  [R-10]
R40  150  RESISTOR-15M  [R-15]
R41  150  RESISTOR-10M  [R-10]
R42  150  RESISTOR-10M  [R-10]
R43  150  RESISTOR-10M  [R-10]
R44  150  RESISTOR-10M  [R-10]
R45  150  RESISTOR-10M  [R-10]
R46  150  RESISTOR-10M  [R-10]
S34  DIP04YL  [DIP04YL]

### Nets
N$106: DSP1.11(A) R39.2
N$110: DSP1.7(B) R40.2
N$111: DSP1.4(C) R41.2
N$112: DSP1.2(D) R42.2
N$113: DSP1.1(E) R43.2
N$114: DSP1.10(F) R44.2
N$115: DSP1.5(G) R45.2
N$116: DSP1.3(DP) R46.2
N$117: Q3.2(B) R36.1
N$118: Q2.2(B) R35.1
N$119: Q5.2(B) R38.1
N$120: Q4.2(B) R37.1
N$121: R37.2 S34.4
N$122: R38.2 S34.3
N$123: R35.2 S34.2
N$124: R36.2 S34.1
N$125: DSP1.6(CA1) Q3.3(C)
N$126: DSP1.8(CA2) Q2.3(C)
N$127: DSP1.9(CA3) Q5.3(C)
N$128: DSP1.12(CA4) Q4.3(C)
P39: S34.5 ; also sheet 1,4,7,10
P40: S34.6 ; also sheet 1,4,7,10
P41: S34.7 ; also sheet 1,4,7,10
P42: S34.8 ; also sheet 1,4,7,10
P44: R45.1 ; also sheet 1,4,7
P45: R44.1 ; also sheet 1,4,7
P46: R43.1 ; also sheet 1,4,7
P47: R42.1 ; also sheet 1,4,7,17
P48: R41.1 ; also sheet 1,4,7,17
P49: R40.1 ; also sheet 1,4,7,17
P50: R39.1 ; also sheet 1,4,6,7
P51: R46.1 ; also sheet 1,4,6,7
VCC: Q2.1(E) Q3.1(E) Q4.1(E) Q5.1(E) ; also sheet 1,2,3,4,5,6,7,8,10,11,12,13,14,15,16,17,18

### Buses
7S-A,7S-B,7S-C,7S-D,7S-E,7S-F,7S-G,7S-P,7S-C[1..4]

## Sheet 10 of 18
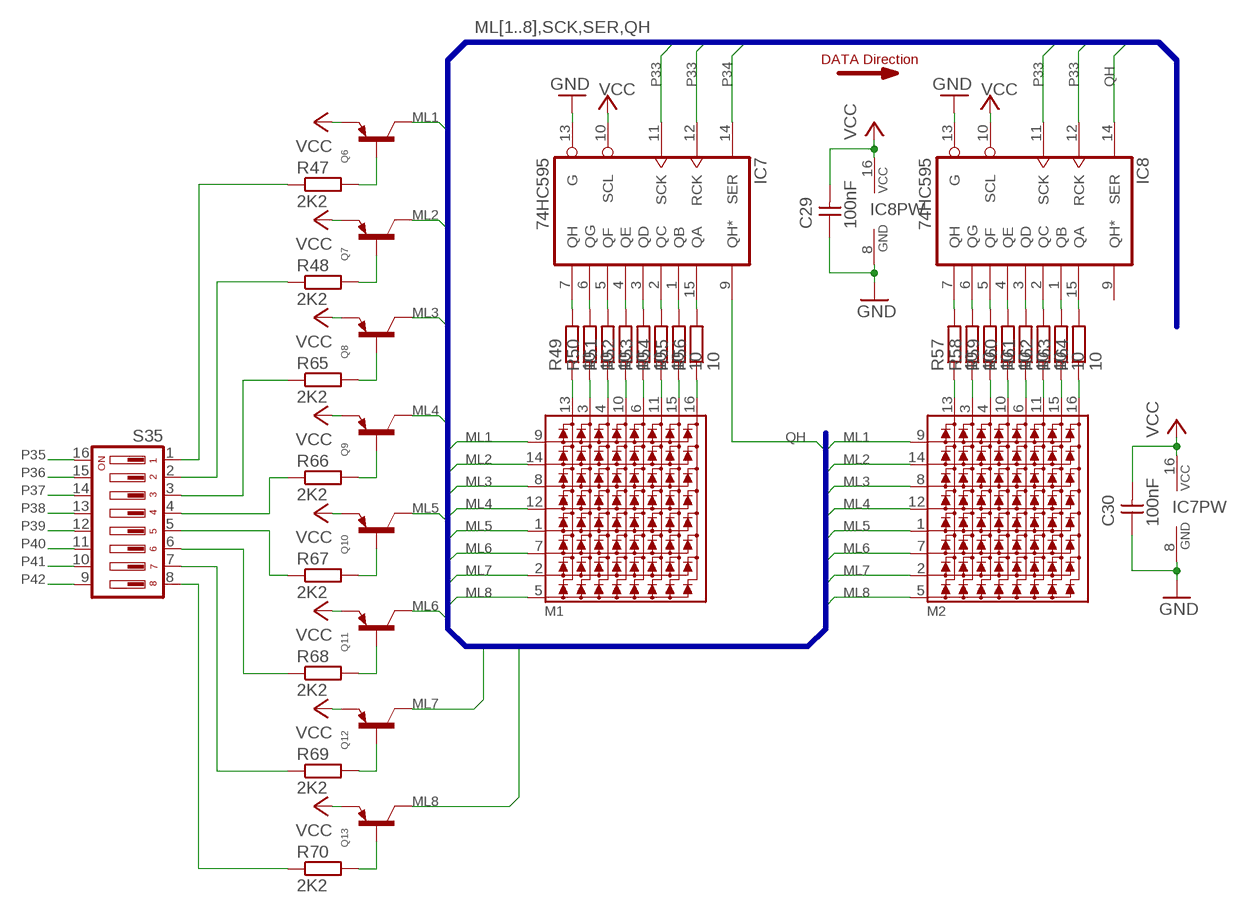
[diagram p9: schematic, sheet 10]

### Parts
C29  100nF  CAP2.5  [CAP2.5]
C30  100nF  CAP2.5  [CAP2.5]
IC7  74HC595  74HC595L  [DIL16L]
IC8  74HC595  74HC595L  [DIL16L]
M1  8X8MATRIX-3MM  [8X8MATRIX-3MM]
M2  8X8MATRIX-3MM  [8X8MATRIX-3MM]
Q6  BC327L  [TO92L]
Q7  BC327L  [TO92L]
Q8  BC327L  [TO92L]
Q9  BC327L  [TO92L]
Q10  BC327L  [TO92L]
Q11  BC327L  [TO92L]
Q12  BC327L  [TO92L]
Q13  BC327L  [TO92L]
R47  2K2  RESISTOR-15M  [R-15]
R48  2K2  RESISTOR-15M  [R-15]
R49  10  RESISTOR-10M  [R-10]
R50  10  RESISTOR-10M  [R-10]
R51  10  RESISTOR-10M  [R-10]
R52  10  RESISTOR-10M  [R-10]
R53  10  RESISTOR-10M  [R-10]
R54  10  RESISTOR-10M  [R-10]
R55  10  RESISTOR-15M  [R-15]
R56  10  RESISTOR-8M  [R-8]
R57  10  RESISTOR-10M  [R-10]
R58  10  RESISTOR-10M  [R-10]
R59  10  RESISTOR-10M  [R-10]
R60  10  RESISTOR-15M  [R-15]
R61  10  RESISTOR-10M  [R-10]
R62  10  RESISTOR-13M  [R-13]
R63  10  RESISTOR-10M  [R-10]
R64  10  RESISTOR-15M  [R-15]
R65  2K2  RESISTOR-15M  [R-15]
R66  2K2  RESISTOR-15M  [R-15]
R67  2K2  RESISTOR-15M  [R-15]
R68  2K2  RESISTOR-15M  [R-15]
R69  2K2  RESISTOR-15M  [R-15]
R70  2K2  RESISTOR-15M  [R-15]
S35  DIP08YL  [DIP08YL]

### Nets
GND: C29.1 C30.1 IC7.8(GND) IC7.13(G) IC8.8(GND) IC8.13(G) ; also sheet 1,2,3,4,5,6,7,8,11,12,13,14,15,16,17,18
ML1: M1.9(R1) M2.9(R1) Q6.3(C)
ML2: M1.14(R2) M2.14(R2) Q7.3(C)
ML3: M1.8(R3) M2.8(R3) Q8.3(C)
ML4: M1.12(R4) M2.12(R4) Q9.3(C)
ML5: M1.1(R5) M2.1(R5) Q10.3(C)
ML6: M1.7(R6) M2.7(R6) Q11.3(C)
ML7: M1.2(R7) M2.2(R7) Q12.3(C)
ML8: M1.5(R8) M2.5(R8) Q13.3(C)
N$1: IC7.7(QH) R49.2
N$162: IC8.7(QH) R57.2
N$163: IC8.6(QG) R58.2
N$164: IC8.4(QE) R60.2
N$165: IC8.3(QD) R61.2
N$166: IC8.2(QC) R62.2
N$167: IC8.1(QB) R63.2
N$168: IC8.15(QA) R64.2
N$169: IC8.5(QF) R59.2
N$170: IC7.6(QG) R50.2
N$171: IC7.4(QE) R52.2
N$172: IC7.3(QD) R53.2
N$173: IC7.2(QC) R54.2
N$174: IC7.1(QB) R55.2
N$175: IC7.15(QA) R56.2
N$176: IC7.5(QF) R51.2
N$177: M1.13(C1) R49.1
N$178: Q6.2(B) R47.2
N$179: Q7.2(B) R48.2
N$180: Q8.2(B) R65.2
N$181: Q9.2(B) R66.2
N$182: Q10.2(B) R67.2
N$183: Q11.2(B) R68.2
N$184: Q12.2(B) R69.2
N$185: Q13.2(B) R70.2
N$193: M1.3(C2) R50.1
N$194: M1.4(C3) R51.1
N$195: M1.10(C4) R52.1
N$196: M1.6(C5) R53.1
N$197: M1.11(C6) R54.1
N$198: M1.15(C7) R55.1
N$199: M1.16(C8) R56.1
N$200: M2.13(C1) R57.1
N$201: M2.3(C2) R58.1
N$202: M2.4(C3) R59.1
N$203: M2.10(C4) R60.1
N$204: M2.6(C5) R61.1
N$205: M2.11(C6) R62.1
N$206: M2.15(C7) R63.1
N$207: M2.16(C8) R64.1
N$272: R47.1 S35.1
N$273: R70.1 S35.8
N$274: R69.1 S35.7
N$275: R48.1 S35.2
N$283: R65.1 S35.3
N$284: R68.1 S35.6
N$285: R67.1 S35.5
N$286: R66.1 S35.4
P33: IC7.11(SCK) IC7.12(RCK) IC8.11(SCK) IC8.12(RCK) ; also sheet 1,17
P34: IC7.14(SER) ; also sheet 1,17
P35: S35.16 ; also sheet 1,4,13
P36: S35.15 ; also sheet 1,4
P37: S35.14 ; also sheet 1,4,7
P38: S35.13 ; also sheet 1,4,7
P39: S35.12 ; also sheet 1,4,7,9
P40: S35.11 ; also sheet 1,4,7,9
P41: S35.10 ; also sheet 1,4,7,9
P42: S35.9 ; also sheet 1,4,7,9
QH: IC7.9(QH*) IC8.14(SER)
VCC: C29.2 C30.2 IC7.10(SCL) IC7.16(VCC) IC8.10(SCL) IC8.16(VCC) Q6.1(E) Q7.1(E) Q8.1(E) Q9.1(E) Q10.1(E) Q11.1(E) Q12.1(E) Q13.1(E) ; also sheet 1,2,3,4,5,6,7,8,9,11,12,13,14,15,16,17,18
Unconnected: IC8.9(QH*)

### Buses
ML[1..8],SCK,SER,QH

### Notes on the sheet
- DATA Direction

## Sheet 11 of 18
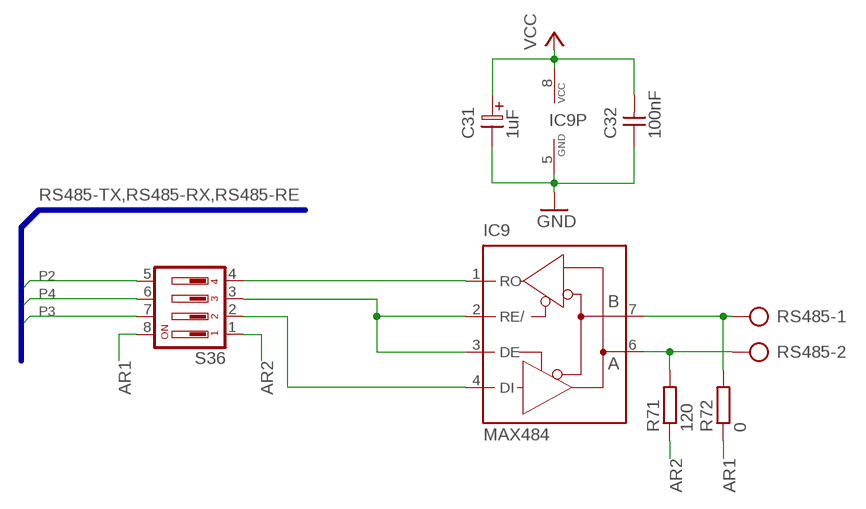
[diagram p10: schematic, sheet 11]

### Parts
C31  1uF  ELC2.5  [ELC2.5]
C32  100nF  CAP2.5  [CAP2.5]
IC9  MAX484  MAX485  [DIL8R]
R71  120  RESISTOR-10M  [R-10]
R72  0  RESISTOR-10M  [R-10]
RS485  AK500/2  [AK500/2]
S36  DIP04YL  [DIP04YL]

### Nets
AR1: R72.1 S36.8
AR2: R71.1 S36.1
AR11: IC9.7(B) R72.2 RS485.1
GND: C31.2 C32.1 IC9.5(GND) ; also sheet 1,2,3,4,5,6,7,8,10,12,13,14,15,16,17,18
N$228: IC9.6(A) R71.2 RS485.2
N$233: IC9.2(RE/) IC9.3(DE) S36.3
N$234: IC9.4(DI) S36.2
N$235: IC9.1(RO) S36.4
P2: S36.5 ; also sheet 1,4,6,12
P3: S36.7 ; also sheet 1,4,6,12
P4: S36.6 ; also sheet 1,4,6,12
VCC: C31.1 C32.2 IC9.8(VCC) ; also sheet 1,2,3,4,5,6,7,8,9,10,12,13,14,15,16,17,18

### Buses
RS485-TX,RS485-RX,RS485-RE

## Sheet 12 of 18
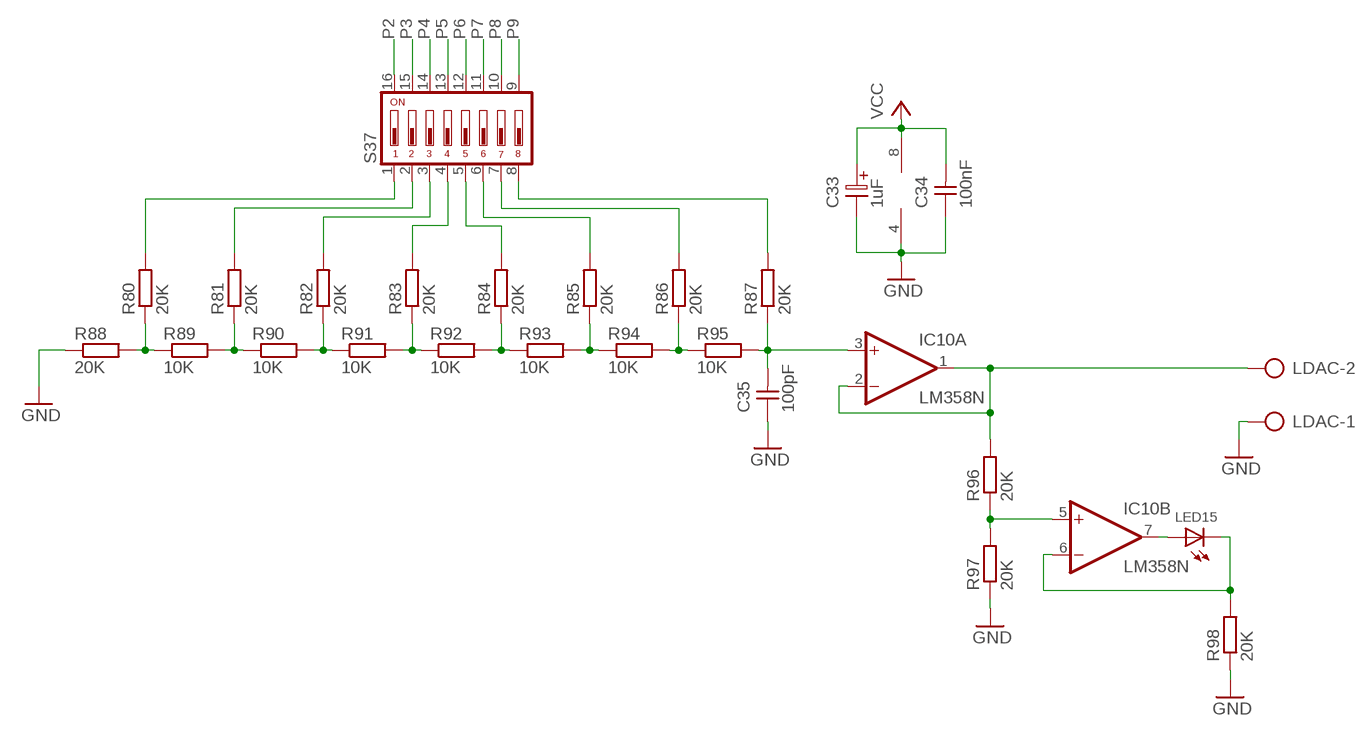
[diagram p11: schematic, sheet 12]

### Parts
C33  1uF  ELC2.5  [ELC2.5]
C34  100nF  CAP2.5  [CAP2.5]
C35  100pF  CAP2.5  [CAP2.5]
IC10  LM358N  [DIL08]
LDAC  AK500/2  [AK500/2]
LED15  LED3  [LED3MM]
R80  20K  RESISTOR-8M  [R-8]
R81  20K  RESISTOR-8M  [R-8]
R82  20K  RESISTOR-8M  [R-8]
R83  20K  RESISTOR-8M  [R-8]
R84  20K  RESISTOR-8M  [R-8]
R85  20K  RESISTOR-8M  [R-8]
R86  20K  RESISTOR-8M  [R-8]
R87  20K  RESISTOR-8M  [R-8]
R88  20K  RESISTOR-8M  [R-8]
R89  10K  RESISTOR-8M  [R-8]
R90  10K  RESISTOR-8M  [R-8]
R91  10K  RESISTOR-8M  [R-8]
R92  10K  RESISTOR-8M  [R-8]
R93  10K  RESISTOR-8M  [R-8]
R94  10K  RESISTOR-8M  [R-8]
R95  10K  RESISTOR-8M  [R-8]
R96  20K  RESISTOR-8M  [R-8]
R97  20K  RESISTOR-8M  [R-8]
R98  20K  RESISTOR-8M  [R-8]
S37  DIP08YL  [DIP08YL]

### Nets
GND: C33.2 C34.1 C35.1 IC10.4(P:V-) LDAC.1 R88.1 R97.1 R98.1 ; also sheet 1,2,3,4,5,6,7,8,10,11,13,14,15,16,17,18
N$208: R80.1 R88.2 R89.1
N$209: R81.1 R89.2 R90.1
N$210: R82.1 R90.2 R91.1
N$211: R83.1 R91.2 R92.1
N$212: R84.1 R92.2 R93.1
N$213: R85.1 R93.2 R94.1
N$214: R86.1 R94.2 R95.1
N$215: C35.2 IC10.3(A:+IN) R87.1 R95.2
N$216: R80.2 S37.1
N$217: R81.2 S37.2
N$218: R82.2 S37.3
N$219: R83.2 S37.4
N$220: R84.2 S37.5
N$221: R85.2 S37.6
N$222: R86.2 S37.7
N$223: R87.2 S37.8
N$224: IC10.1(A:OUT) IC10.2(A:-IN) LDAC.2 R96.2
N$225: IC10.5(B:+IN) R96.1 R97.2
N$226: IC10.6(B:-IN) LED15.K(C) R98.2
N$227: IC10.7(B:OUT) LED15.A
P2: S37.16 ; also sheet 1,4,6,11
P3: S37.15 ; also sheet 1,4,6,11
P4: S37.14 ; also sheet 1,4,6,11
P5: S37.13 ; also sheet 1,4,6,18
P6: S37.12 ; also sheet 1,4,5
P7: S37.11 ; also sheet 1,4,5
P8: S37.10 ; also sheet 1,4,5
P9: S37.9 ; also sheet 1,4,5
VCC: C33.1 C34.2 IC10.8(P:V+) ; also sheet 1,2,3,4,5,6,7,8,9,10,11,13,14,15,16,17,18

## Sheet 13 of 18
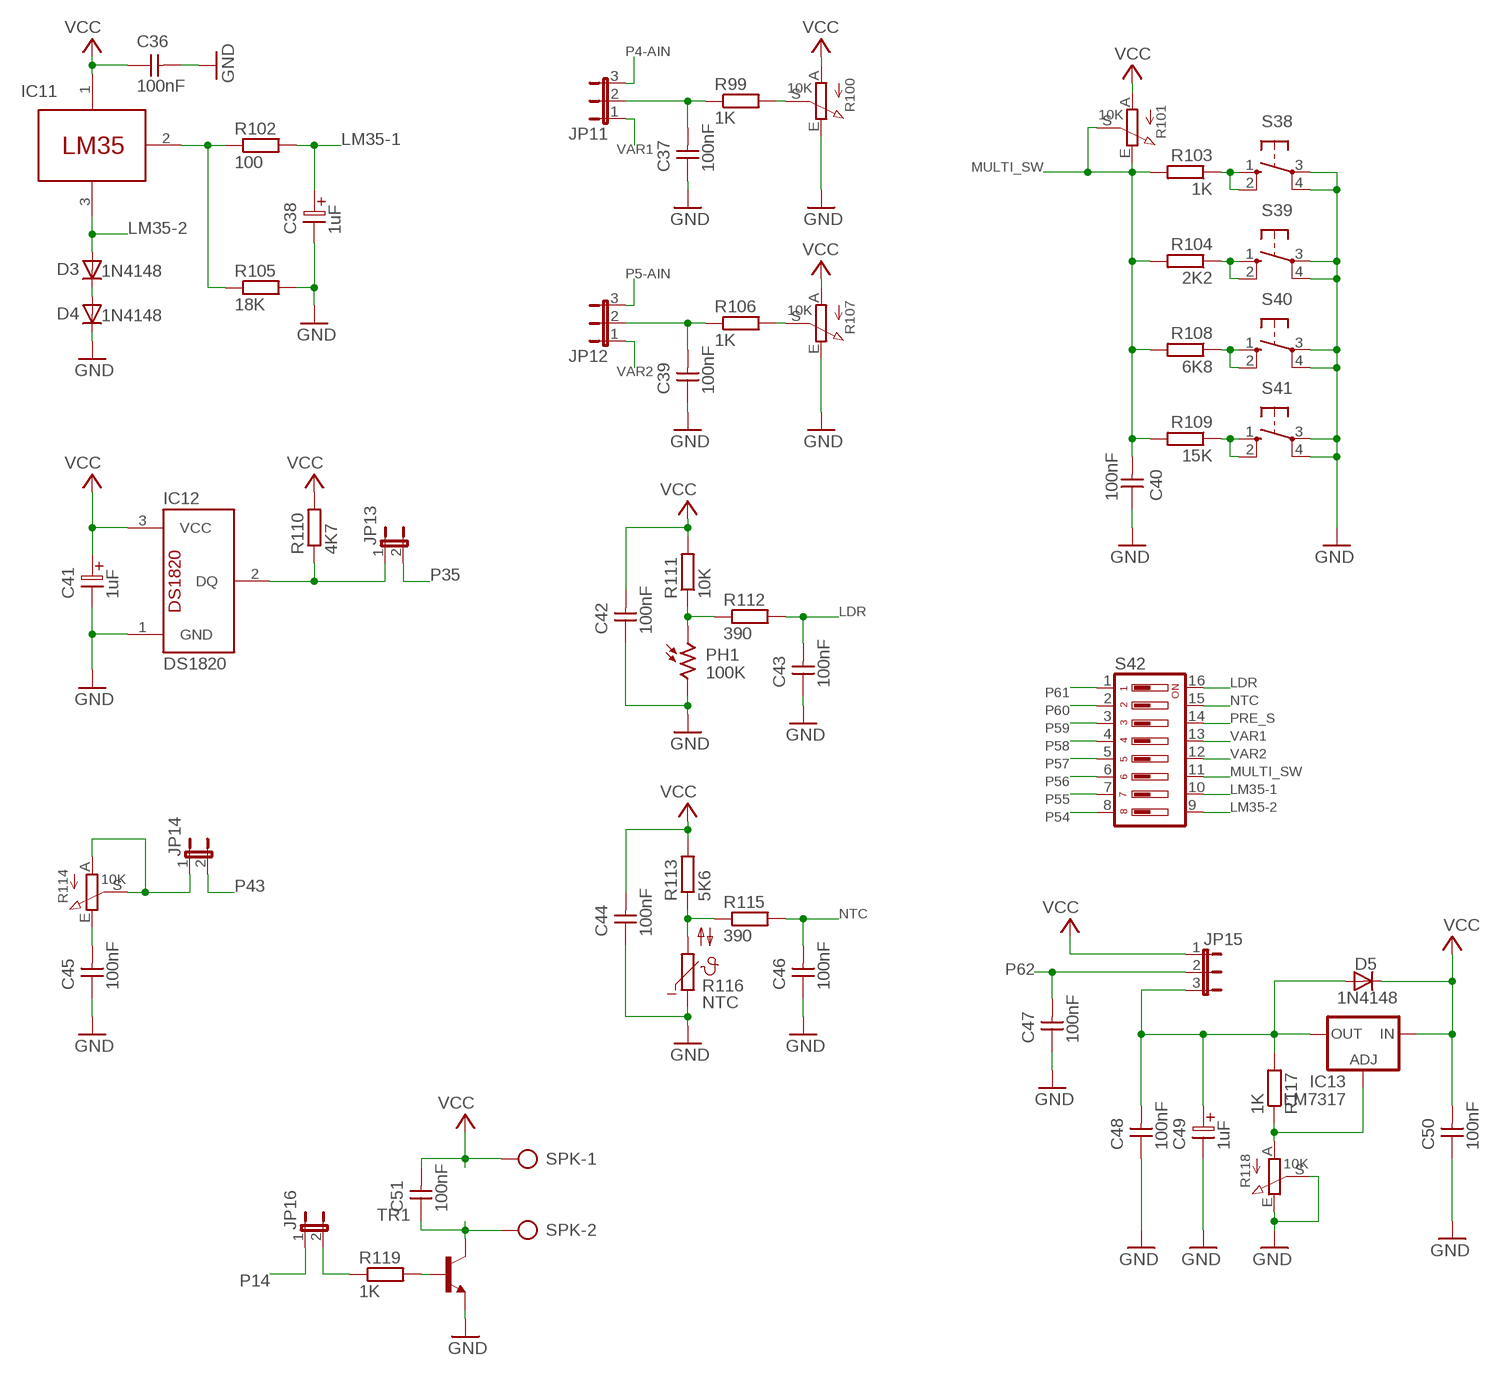
[diagram p12: schematic, sheet 13]

### Parts
C36  100nF  CAP2.5  [CAP2.5]
C37  100nF  CAP2.5  [CAP2.5]
C38  1uF  ELC2.5  [ELC2.5]
C39  100nF  CAP2.5  [CAP2.5]
C40  100nF  CAP2.5  [CAP2.5]
C41  1uF  ELC2.5  [ELC2.5]
C42  100nF  CAP2.5  [CAP2.5]
C43  100nF  CAP2.5  [CAP2.5]
C44  100nF  CAP2.5  [CAP2.5]
C45  100nF  CAP5  [CAP5]
C46  100nF  CAP2.5  [CAP2.5]
C47  100nF  CAP2.5  [CAP2.5]
C48  100nF  CAP2.5  [CAP2.5]
C49  1uF  ELC2.5  [ELC2.5]
C50  100nF  CAP2.5  [CAP2.5]
C51  100nF  CAP2.5  [CAP2.5]
D3  1N4148  1N4148-7  [DO35-7]
D4  1N4148  1N4148-7  [DO35-7]
D5  1N4148  [DO35-10]
IC11  LM35  [LM35]
IC12  DS1820  [TO92L]
IC13  LM7317  LM317TL  [317TL]
JP11  JP2E  [JP2]
JP12  JP2E  [JP2]
JP13  JP1EY  [JP1Y]
JP14  JP1EY  [JP1Y]
JP15  JP2E  [JP2]
JP16  JP1EY  [JP1Y]
PH1  100K  V1060_32  [TO-5_V10]
R99  1K  RESISTOR-10M  [R-10]
R100  10K  POT  [POT]
R101  10K  POT  [POT]
R102  100  RESISTOR-10M  [R-10]
R103  1K  RESISTOR-7M  [R-7]
R104  2K2  RESISTOR-7M  [R-7]
R105  18K  RESISTOR-10M  [R-10]
R106  1K  RESISTOR-10M  [R-10]
R107  10K  POT  [POT]
R108  6K8  RESISTOR-7M  [R-7]
R109  15K  RESISTOR-7M  [R-7]
R110  4K7  RESISTOR-10M  [R-10]
R111  10K  RESISTOR-10M  [R-10]
R112  390  RESISTOR-10M  [R-10]
R113  5K6  RESISTOR-10M  [R-10]
R114  10K  POT  [POT]
R115  390  RESISTOR-10M  [R-10]
R116  NTC  B57164  [B57164]
R117  1K  RESISTOR-10M  [R-10]
R118  10K  POT  [POT]
R119  1K  RESISTOR-10M  [R-10]
S38  TAC_SW_M  [B3F-10XX]
S39  TAC_SW_M  [B3F-10XX]
S40  TAC_SW_M  [B3F-10XX]
S41  TAC_SW_M  [B3F-10XX]
S42  DIP08YL  [DIP08YL]
SPK  AK500/2  [AK500/2]
TR1  8050  [TO92L]

### Nets
GETRC: JP14.1 R114.A R114.S
GND: C36.2 C37.1 C38.2 C39.1 C40.1 C41.2 C42.1 C43.1 C44.1 C45.1 C46.1 C47.1 C48.1 C49.2 C50.1 D4.C IC12.1(GND) PH1.2 R100.E R105.2 R107.E R116.1 R118.E R118.S S38.3(P) S38.4(P1) S39.3(P) S39.4(P1) S40.3(P) S40.4(P1) S41.3(P) S41.4(P1) TR1.1(E) ; also sheet 1,2,3,4,5,6,7,8,10,11,12,14,15,16,17,18
LDR: C43.2 R112.2 S42.16
LM35-1: C38.1 R102.2 S42.10
LM35-2: D3.A IC11.3(GND) S42.9
MULTI_SW: C40.2 R101.E R101.S R103.2 R104.2 R108.2 R109.2 S42.11
N$129: IC11.2(VO) R102.1 R105.1
N$130: D3.C D4.A
N$137: IC12.2(DQ) JP13.1 R110.1
N$146: R99.2 R100.S
N$147: R106.2 R107.S
N$148: C37.2 JP11.2 R99.1
N$149: C39.2 JP12.2 R106.1
N$151: PH1.1 R111.1 R112.1
N$152: R104.1 S39.1(S) S39.2(S1)
N$153: R108.1 S40.1(S) S40.2(S1)
N$154: R109.1 S41.1(S) S41.2(S1)
N$155: C51.1 SPK.2 TR1.3(C)
N$156: R103.1 S38.1(S) S38.2(S1)
N$157: JP16.2 R119.1
N$158: R113.1 R115.1 R116.2
N$159: R119.2 TR1.2(B)
N$160: C48.2 C49.1 D5.A IC13.2(OUT) JP15.3 R117.2
N$161: IC13.1(ADJ) R117.1 R118.A
N$236: C45.2 R114.E
NTC: C46.2 R115.2 S42.15
P4-AIN: JP11.3
P5-AIN: JP12.3
P14: JP16.1 ; also sheet 1,4,5
P35: JP13.2 ; also sheet 1,4,10
P43: JP14.2 ; also sheet 1,16
P54: S42.8 ; also sheet 1,4
P55: S42.7 ; also sheet 1,4
P56: S42.6 ; also sheet 1,4
P57: S42.5 ; also sheet 1,4
P58: S42.4 ; also sheet 1,4
P59: S42.3 ; also sheet 1,4
P60: S42.2 ; also sheet 1,4
P61: S42.1 ; also sheet 1,4
P62: C47.2 JP15.2 ; also sheet 1
PRE_S: S42.14 ; also sheet 14
VAR1: JP11.1 S42.13
VAR2: JP12.1 S42.12
VCC: C36.1 C41.1 C42.2 C44.2 C50.2 C51.2 D5.C IC11.1(VCC) IC12.3(VCC) IC13.3(IN) JP15.1 R100.A R101.A R107.A R110.2 R111.2 R113.2 SPK.1 ; also sheet 1,2,3,4,5,6,7,8,9,10,11,12,14,15,16,17,18

## Sheet 14 of 18
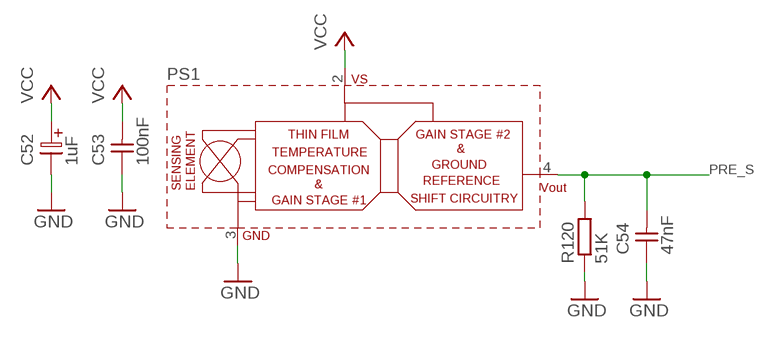
[diagram p13: schematic, sheet 14]

### Parts
C52  1uF  ELC2.5  [ELC2.5]
C53  100nF  CAP2.5  [CAP2.5]
C54  47nF  CAP2.5  [CAP2.5]
PS1  MPXAZ6115A  [MPXAZ6115A]
R120  51K  RESISTOR-10M  [R-10]

### Nets
GND: C52.2 C53.1 C54.1 PS1.3(GND) R120.1 ; also sheet 1,2,3,4,5,6,7,8,10,11,12,13,15,16,17,18
PRE_S: C54.2 PS1.4(VO) R120.2 ; also sheet 13
VCC: C52.1 C53.2 PS1.2(VS) ; also sheet 1,2,3,4,5,6,7,8,9,10,11,12,13,15,16,17,18

## Sheet 15 of 18
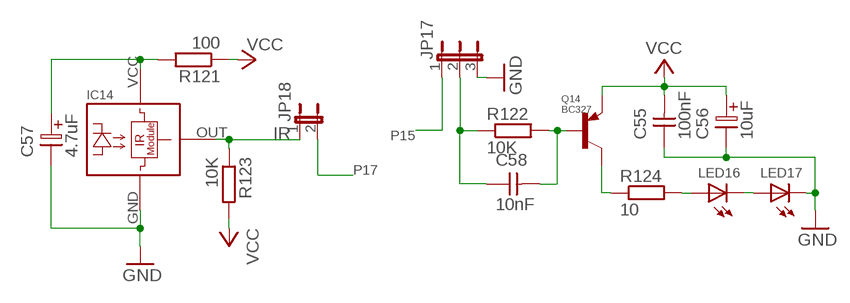
[diagram p14: schematic, sheet 15]

### Parts
C55  100nF  CAP2.5  [CAP2.5]
C56  10uF  ELC2.5  [ELC2.5]
C57  4.7uF  ELC2.5  [ELC2.5]
C58  10nF  CAP2.5  [CAP2.5]
IC14  IR-RECEIVERIR  [IR-RECEIVER]
JP17  JP2E  [JP2]
JP18  JP1EY  [JP1Y]
LED16  LED5  [LED5MM]
LED17  LED5  [LED5MM]
Q14  BC327  BC327L  [TO92L]
R121  100  RESISTOR-7M  [R-7]
R122  10K  RESISTOR-7M  [R-7]
R123  10K  RESISTOR-7M  [R-7]
R124  10  RESISTOR-7M  [R-7]

### Nets
+VIR: C57.1 IC14.VCC R121.2
ASAS: C58.1 JP17.2 R122.1
GND: C55.1 C56.2 C57.2 IC14.GND JP17.3 LED17.K(C) ; also sheet 1,2,3,4,5,6,7,8,10,11,12,13,14,16,17,18
IR: IC14.OUT JP18.1 R123.1
N$133: C58.2 Q14.2(B) R122.2
N$134: LED16.A R124.2
N$135: Q14.3(C) R124.1
N$136: LED16.K(C) LED17.A
P15: JP17.1 ; also sheet 1,4,5
P17: JP18.2 ; also sheet 1,4,5
VCC: C55.2 C56.1 Q14.1(E) R121.1 R123.2 ; also sheet 1,2,3,4,5,6,7,8,9,10,11,12,13,14,16,17,18

## Sheet 16 of 18
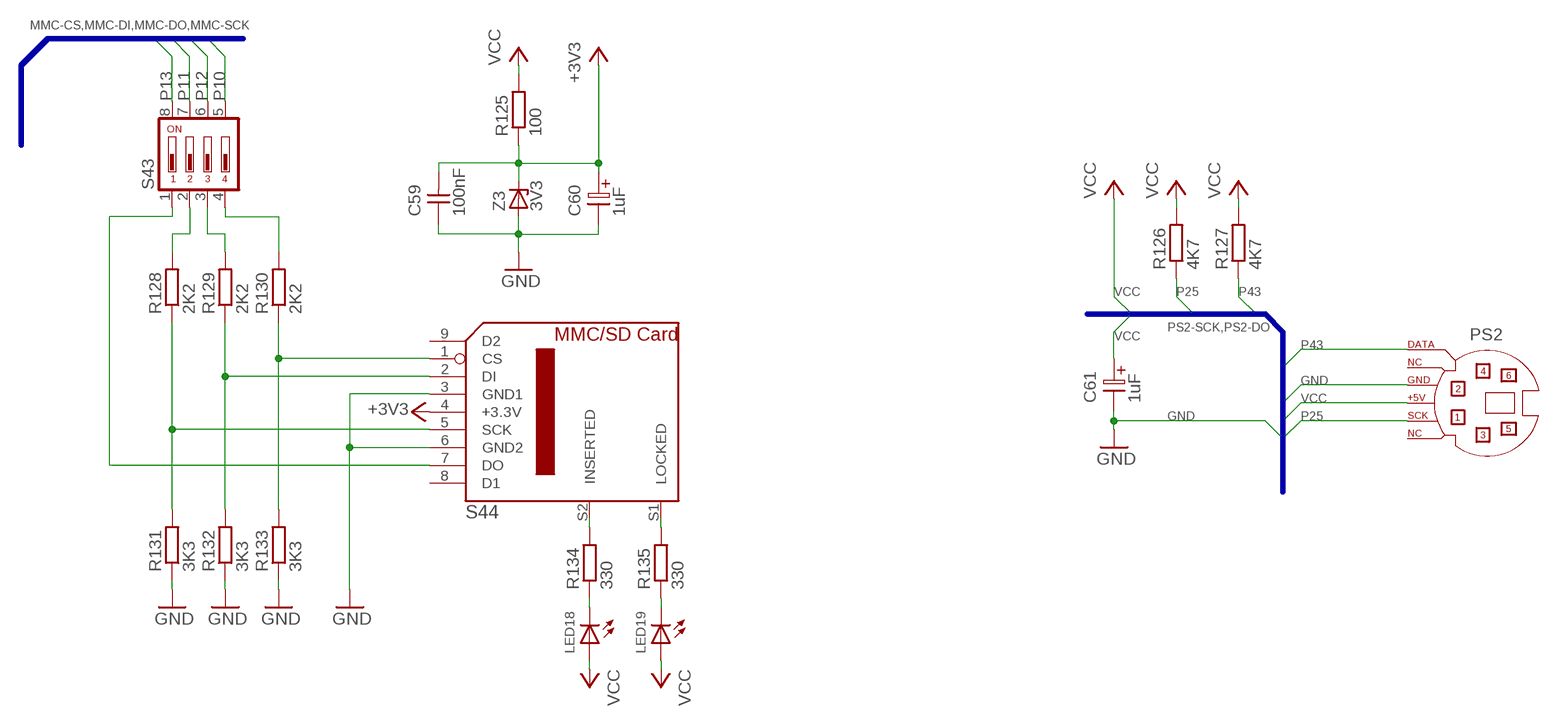
[diagram p15: schematic, sheet 16]

### Parts
C59  100nF  CAP2.5  [CAP2.5]
C60  1uF  ELC2.5  [ELC2.5]
C61  1uF  ELC2.5  [ELC2.5]
LED18  LED3  [LED3MM]
LED19  LED3  [LED3MM]
PS2  PS2-CON  [PS2-CON]
R125  100  RESISTOR-10M  [R-10]
R126  4K7  RESISTOR-10M  [R-10]
R127  4K7  RESISTOR-10M  [R-10]
R128  2K2  RESISTOR-7M  [R-7]
R129  2K2  RESISTOR-10M  [R-10]
R130  2K2  RESISTOR-10M  [R-10]
R131  3K3  RESISTOR-10M  [R-10]
R132  3K3  RESISTOR-10M  [R-10]
R133  3K3  RESISTOR-7M  [R-7]
R134  330  RESISTOR-7M  [R-7]
R135  330  RESISTOR-7M  [R-7]
S43  DIP04YL  [DIP04YL]
S44  MMC-SD-CARDP  [MMC-SD-CARD-P]
Z3  3V3  ZENER12  [SOD120]

### Nets
+3V3: C59.2 C60.1 R125.1 S44.4(+3.3V) Z3.C
GND: C59.1 C60.2 C61.2 PS2.3 R131.1 R132.1 R133.1 S44.3(GND1) S44.6(GND2) Z3.A ; also sheet 1,2,3,4,5,6,7,8,10,11,12,13,14,15,17,18
N$98: R134.2 S44.S2(INSERTED)
N$99: LED18.K(C) R134.1
N$100: R135.2 S44.S1(LOCKED)
N$101: LED19.K(C) R135.1
N$102: R128.1 R131.2 S44.5(SCK)
N$103: R129.1 R132.2 S44.2(DI)
N$104: R130.1 R133.2 S44.1(CS)
N$105: S43.1 S44.7(DO)
N$107: R130.2 S43.4
N$108: R129.2 S43.3
N$109: R128.2 S43.2
P10: S43.5 ; also sheet 1,4,5
P11: S43.7 ; also sheet 1,3,4,5
P12: S43.6 ; also sheet 1,3,4,5
P13: S43.8 ; also sheet 1,3,4,5
P25: PS2.5 R126.1 ; also sheet 1,4,5,8
P43: PS2.1 R127.1 ; also sheet 1,13
VCC: C61.1 LED18.A LED19.A PS2.4 R125.2 R126.2 R127.2 ; also sheet 1,2,3,4,5,6,7,8,9,10,11,12,13,14,15,17,18
Unconnected: PS2.2 PS2.6 S44.8(D1) S44.9(D2)

### Buses
MMC-CS,MMC-DI,MMC-DO,MMC-SCK
PS2-SCK,PS2-DO

## Sheet 17 of 18
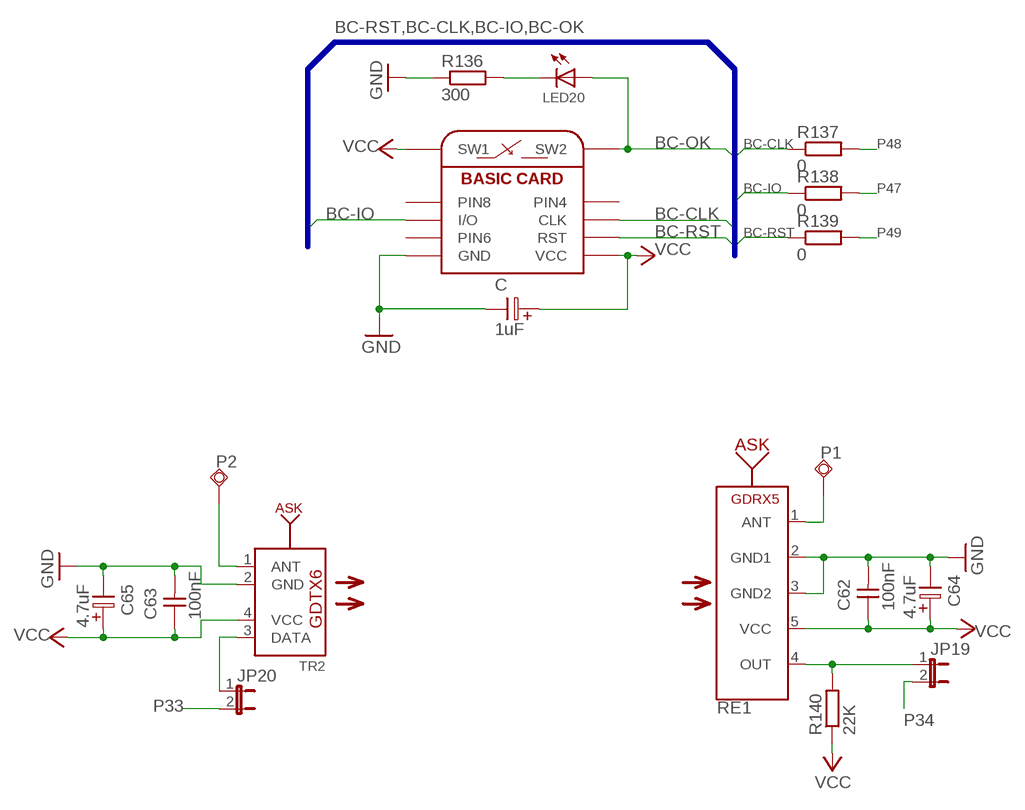
[diagram p16: schematic, sheet 17]

### Parts
C  1uF  ELC2.5  [ELC2.5]
C62  100nF  CAP2.5  [CAP2.5]
C63  100nF  CAP2.5  [CAP2.5]
C64  4.7uF  ELC2.5  [ELC2.5]
C65  4.7uF  ELC2.5  [ELC2.5]
JP19  JP1EY  [JP1Y]
JP20  JP1EY  [JP1Y]
LED20  LED3  [LED3MM]
P1  PADX  [PAD1]
P2  PADX  [PAD1]
R136  300  RESISTOR-10M  [R-10]
R137  0  RESISTOR-13M  [R-13]
R138  0  RESISTOR-15M  [R-15]
R139  0  RESISTOR-12M  [R-12]
R140  22K  RESISTOR-10M  [R-10]
RE1  GDRX5-ASK  [GDRX5]
TR2  GDTX6-ASK  [GDTX6]
U$1  SMARTCARD  [CARDSOCKET]

### Nets
BC-CLK: R137.1 U$1.CLK
BC-IO: R138.1 U$1.I/O
BC-OK: LED20.A U$1.SW2
BC-RST: R139.1 U$1.RST
GND: C62.2 C63.2 C64.2 C65.2 C.2 R136.1 RE1.2(GND1) RE1.3(GND2) TR2.2(GND) U$1.GND ; also sheet 1,2,3,4,5,6,7,8,10,11,12,13,14,15,16,18
N$186: P2.1(TP) TR2.1(ANT)
N$187: LED20.K(C) R136.2
N$188: P1.1(TP) RE1.1(ANT)
N$190: JP19.1 R140.2 RE1.4(OUT)
N$191: JP20.1 TR2.3(DATA)
P33: JP20.2 ; also sheet 1,10
P34: JP19.2 ; also sheet 1,10
P47: R138.2 ; also sheet 1,4,7,9
P48: R137.2 ; also sheet 1,4,7,9
P49: R139.2 ; also sheet 1,4,7,9
VCC: C62.1 C63.1 C64.1 C65.1 C.1 R140.1 RE1.5(VCC) TR2.4(VCC) U$1.SW1 U$1.VCC ; also sheet 1,2,3,4,5,6,7,8,9,10,11,12,13,14,15,16,18
Unconnected: U$1.PIN4 U$1.PIN6 U$1.PIN8

### Buses
BC-RST,BC-CLK,BC-IO,BC-OK

## Sheet 18 of 18
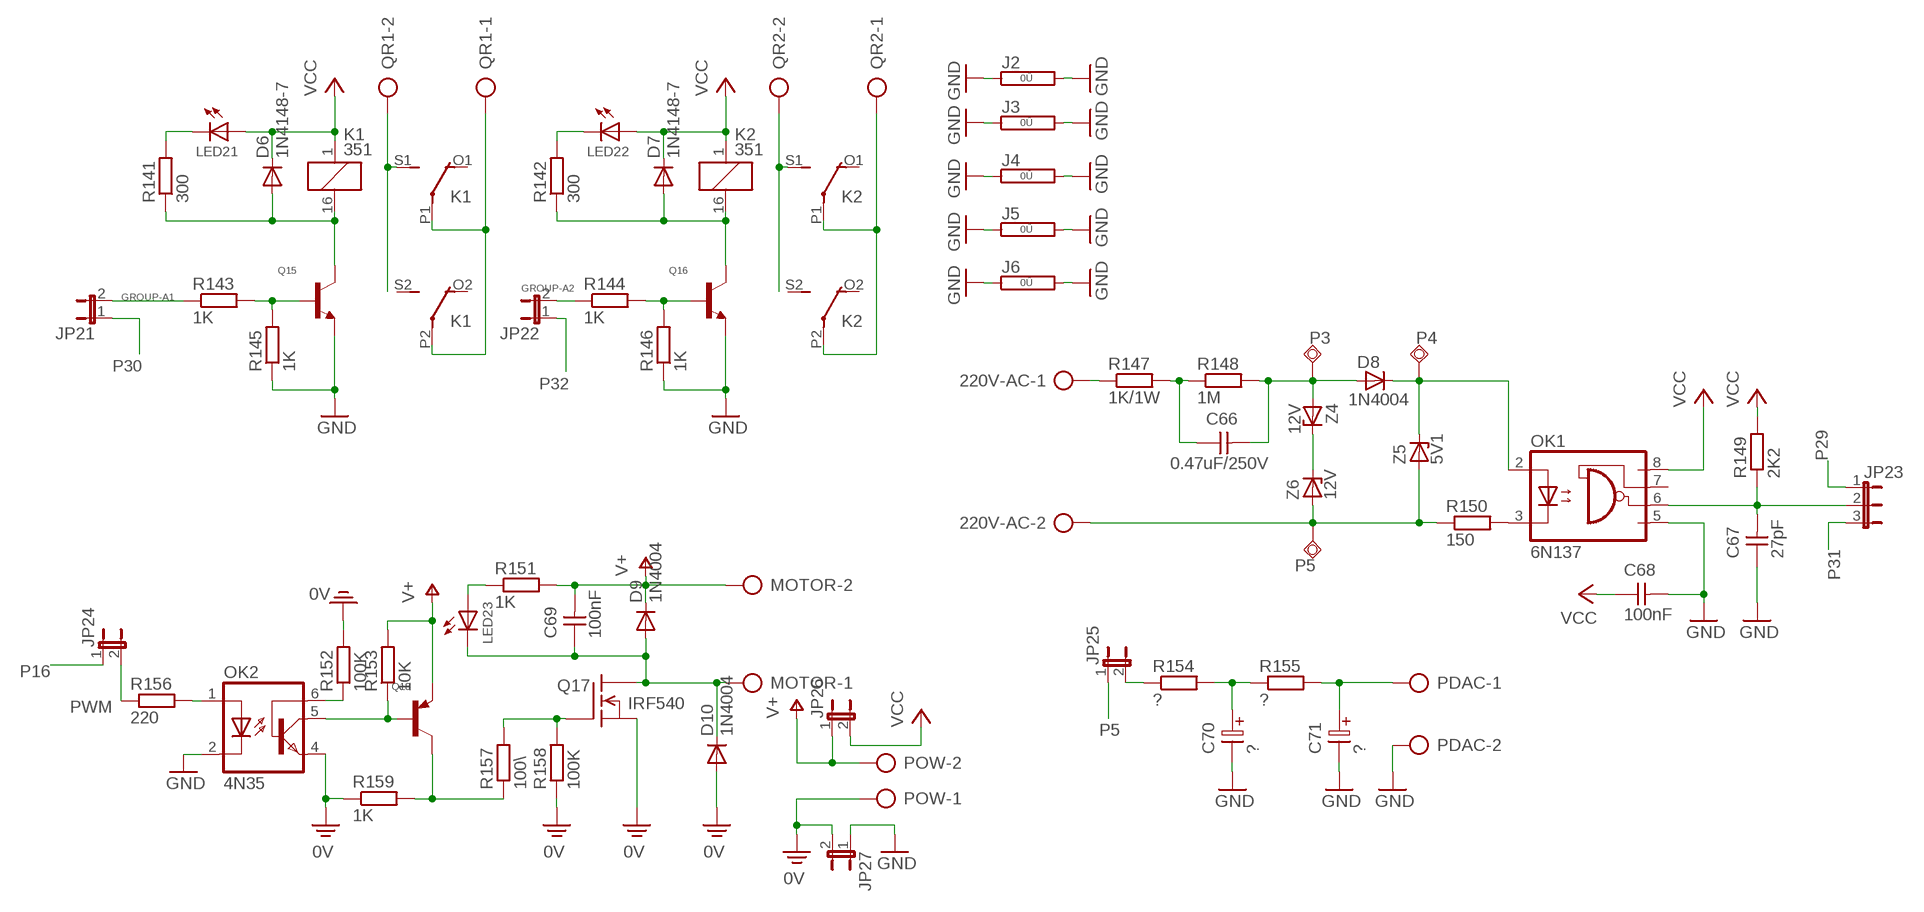
[diagram p17: schematic, sheet 18]

### Parts
220V-AC  AK500/2  [AK500/2]
C66  0.47uF/250V  CAP10BS  [CXXC10BS]
C67  27pF  CAP2.5  [CAP2.5]
C68  100nF  CAP2.5  [CAP2.5]
C69  100nF  CAP7BS  [CXXC7BS]
C70  ?  ELC2.5  [ELC2.5]
C71  ?  ELC2.5  [ELC2.5]
D6  1N4148-7  [DO35-7]
D7  1N4148-7  [DO35-7]
D8  1N4004  [DO41-10]
D9  1N4004  [DO41-10]
D10  1N4004  [DO41-10]
J2  0R5  [05]
J3  0R7  [07]
J4  0R5  [05]
J5  0R5  [05]
J6  0R5  [05]
JP21  JP1EY  [JP1Y]
JP22  JP1EY  [JP1Y]
JP23  JP2E  [JP2]
JP24  JP1EY  [JP1Y]
JP25  JP1EY  [JP1Y]
JP26  JP1E  [JP1]
JP27  JP1E  [JP1]
K1  351  [351]
K2  351  [351]
LED21  LED3  [LED3MM]
LED22  LED3  [LED3MM]
LED23  LED3  [LED3MM]
MOTOR  AK500/2  [AK500/2]
OK1  6N137  [DIL08]
OK2  4N35  [DIL06]
P3  PADB  [PAD0]
P4  PADB  [PAD0]
P5  PADB  [PAD0]
PDAC  AK500/2  [AK500/2]
POW  AK500/2  [AK500/2]
Q15  BC337L  [TO92L]
Q16  BC337L  [TO92L]
Q17  IRF540  [TO220]
Q18  BC327L  [TO92L]
QR1  AK500/2  [AK500/2]
QR2  AK500/2  [AK500/2]
R141  300  RESISTOR-10M  [R-10]
R142  300  RESISTOR-10M  [R-10]
R143  1K  RESISTOR-7M  [R-7]
R144  1K  RESISTOR-7M  [R-7]
R145  1K  RESISTOR-7M  [R-7]
R146  1K  RESISTOR-7M  [R-7]
R147  1K/1W  RESISTOR-10M  [R-10]
R148  1M  RESISTOR-10M  [R-10]
R149  2K2  RESISTOR-7M  [R-7]
R150  150  RESISTOR-10M  [R-10]
R151  1K  RESISTOR-7M  [R-7]
R152  100K  RESISTOR-10M  [R-10]
R153  10K  RESISTOR-10M  [R-10]
R154  ?  RESISTOR-10M  [R-10]
R155  ?  RESISTOR-10M  [R-10]
R156  220  RESISTOR-7M  [R-7]
R157  100\  RESISTOR-10M  [R-10]
R158  100K  RESISTOR-8M  [R-8]
R159  1K  RESISTOR-10M  [R-10]
Z4  12V  ZENER  [SOD81]
Z5  5V1  ZENER  [SOD81]
Z6  12V  ZENER  [SOD81]

### Nets
GND: C67.1 C68.2 C70.2 C71.2 J2.1 J2.2 J3.1 J3.2 J4.1 J4.2 J5.1 J5.2 J6.1 J6.2 JP27.1 OK1.5(GND) OK2.2(C) PDAC.2 Q15.3(E) Q16.3(E) R145.1 R146.1 ; also sheet 1,2,3,4,5,6,7,8,10,11,12,13,14,15,16,17
GROUP-A1: JP21.2 R143.1
GROUP-A2: JP22.2 R144.1
N$150: C70.1 R154.2 R155.1
N$231: C71.1 PDAC.1 R155.2
N$232: JP25.2 R154.1
N$238: Q15.1(B) R143.2 R145.2
N$239: LED21.K(C) R141.2
N$240: D6.A K1.16 Q15.2(C) R141.1
N$241: K1.S1(2:S) QR1.2
N$242: Q16.1(B) R144.2 R146.2
N$243: LED22.K(C) R142.2
N$244: D7.A K2.16 Q16.2(C) R142.1
N$245: K2.S1(2:S) QR2.2
N$246: OK2.5(COL) Q18.2(B) R153.1
N$247: Q17.1(G) R157.2 R158.2
N$248: OK2.1(A) R156.2
N$249: C69.1 D9.A D10.C LED23.K(C) MOTOR.1 Q17.2(D)
N$250: LED23.A R151.1
N$251: OK2.6(BAS) R152.1
N$252: Q18.3(C) R157.1 R159.2
N$253: 220V-AC.1 R147.1
N$254: K1.P1(2:P) K1.P2(3:P) QR1.1
N$255: C66.1 R147.2 R148.1
N$256: K2.P1(2:P) K2.P2(3:P) QR2.1
N$257: C66.2 D8.A P3.1(TP) R148.2 Z4.A
N$258: 220V-AC.2 P5.1(TP) R150.1 Z5.A Z6.A
N$259: OK1.3(C) R150.2
N$260: D8.C OK1.2(A) P4.1(TP) Z5.C
N$262: Z4.C Z6.C
P5: JP25.1 ; also sheet 1,4,6,12
P16: JP24.1 ; also sheet 1,4,5
P29: JP23.1 ; also sheet 1,4
P30: JP21.1 ; also sheet 1,4
P31: JP23.3 ; also sheet 1,4
P32: JP22.1 ; also sheet 1,4
PE: D10.A JP27.2 OK2.4(EMI) POW.1 Q17.3(S) R152.2 R158.1 R159.1 ; supply symbol labelled 0V
PULS: C67.2 JP23.2 OK1.6(VO) R149.1
PWM: JP24.2 R156.1
V+: C69.2 D9.C JP26.1 MOTOR.2 POW.2 Q18.1(E) R151.2 R153.2
VCC: C68.1 D6.C D7.C JP26.2 K1.1 K2.1 LED21.A LED22.A OK1.8(VCC) R149.2 ; also sheet 1,2,3,4,5,6,7,8,9,10,11,12,13,14,15,16,17
Unconnected: K1.O1(2:O) K1.O2(3:O) K1.S2(3:S) K2.O1(2:O) K2.O2(3:O) K2.S2(3:S) OK1.7(VE)

### Notes on the sheet
- 1 | 2

## Library data of the parts
220V-AC LDAC MOTOR PDAC POW PWR1-PWR4 QR1 QR2 RS485 SPK = WALID2008A:AK500/2: CONNECTOR
B1 = WALID2008A:RB1A: RECTIFIER 1 A
B2 = WALID2006:BATT
C C1-C5 C7 C8 C11 C15-C25 C27 C31 C33 C38 C41 C49 C52 C56 C57 C60 C61 C64 C65 C70 C71 = WALID2008A:ELC: Electric Capacitor
C6 C9 C10 C12-C14 C26 C28-C30 C32 C34-C37 C39 C40 C42-C48 C50 C51 C53-C55 C58 C59 C62 C63 C66-C69 = WALID2008A:CAP: Ceramic Capacitor
COM1 COM2 = WALID2008A:F09HP: SUB-D
D1 D8-D10 = WALID2008A:1N4004: DIODE general purpose rectifier, 1 A
D2-D7 = WALID2008A:1N4148: DIODE high speed (Philips)
DSP1 = WALID2008A:DISPLAY-Q0.56': LED DISPLAY 1-character 7 segment, decimal point right
GLCD = WALID2008A:LCD128X64: HDM64GS12 128 X 64 Dots Graphic Source: http://www.hantronix.com/down/64gs12-r.pdf
IC1 = WALID2008A:78XXL: VOLTAGE REGULATOR
IC2 = WALID2008A:74*244: Octal BUFFER and LINE DRIVER, 3-state
IC3 IC4 = WALID2008A:MAX232: RS232 TRANSEIVER
IC5 = WALID2008A:AT24C*: 2-wire serial EEPROM
IC6 = WALID2008A:DS1307
IC7 IC8 = WALID2008A:74HC595
IC9 = WALID2008A:MAX485: RS485 TRANSEIVER
IC10 = linear:LM358: OP AMP also LM158; LM258; LM2904 Source: http://cache.national.com/ds/LM/LM158.pdf
IC11 = WALID2008A:LM35: Temperature Sensor
IC12 = WALID2008A:DS1820: 1?WireTM Digital Thermometer
IC13 = WALID2008A:LM317TL: VOLTAGE REGULATOR
IC14 = WALID2008A:IR-RECEIVER: IR Receiver
J1 = jumper:J: Bridge
J2-J6 = WALID2008A:0R: Bridge 0R 10mm
JP1-JP6 JP8 JP11 JP12 JP15 JP17 JP23 = jumper:JP2E: JUMPER
JP7 JP9 JP10 JP13 JP14 JP16 JP18-JP22 JP24-JP27 = jumper:JP1E: JUMPER
K1 K2 = relay:351: RELAY 2 x switch, Omron
LCD = WALID2008A:LCD20X4: Tuxgraphics LCD display 20x2 characters reflective, without background light Source: tuxgr_20x2.pdf
LED1 LED3-LED10 LED15-LED23 = WALID2008A:LED: LED 3mm, 5mm
LED2 LED11-LED14 = led:LED: LED OSRAM: - CHIPLED LG R971, LG N971, LY N971, LG Q971, LY Q971, LO R971, LY R971 LH N974, LH R974 LS Q976, LO Q976, LY Q976 LO Q996 - Hyper CHIPLED LW Q18S LB Q993, LB Q99A, LB R99A - SideLED LS A670, LO A670, LY A670, LG A670, LP A670 LB A673, LV A673, LT A673, LW A673 LH A674 LY A675 LS A676, LA A676, LO A676, LY A676, LW A676 LS A679, LY A679, LG A679 - Hyper Micro SIDELED® LS Y876, LA Y876, LO Y876, LY Y876 LT Y87S - SmartLED LW L88C, LW L88S LB L89C, LB L89S, LG L890 LS L89K, LO L89K, LY L89K LS L896, LA L896, LO L896, LY L896 - TOPLED LS T670, LO T670, LY T670, LG T670, LP T670 LSG T670, LSP T670, LSY T670, LOP T670, LYG T670 LG T671, LOG T671, LSG T671 LB T673, LV T673, LT T673, LW T673 LH T674 LS T676, LA T676, LO T676, LY T676, LB T676, LH T676, LSB T676, LW T676 LB T67C, LV T67C, LT T67C, LS T67K, LO T67K, LY T67K, LW E67C LS E67B, LA E67B, LO E67B, LY E67B, LB E67C, LV E67C, LT E67C LW T67C LS T679, LY T679, LG T679 LS T770, LO T770, LY T770, LG T770, LP T770 LB T773, LV T773, LT T773, LW T773 LH T774 LS E675, LA E675, LY E675, LS T675 LS T776, LA T776, LO T776, LY T776, LB T776 LHGB T686 LT T68C, LB T68C - Hyper Mini TOPLED® LB M676 - Mini TOPLED Santana® LG M470 LS M47K, LO M47K, LY M47K Source: http://www.osram.convergy.de/
LPT = WALID2008A:F25HP: SUB-D
M1 M2 = WALID2008A:8X8MATRIX-3MM: 8x8 Matrix / 3mm
OK1 = optocoupler:6N137: MOTOROLA OPTO COUPLER
OK2 = optocoupler:4N35: MOTOROLA OPTO COUPLER
P1-P5 = WALID2008A:PAD: PAD
PH1 = photo-elements:?1060*: Sensor Street Light control Source: http://optoelectronics.perkinelmer.com/content/Datasheets/DTS_PhotocellsB1060.pdf
PORTA PORTB PORTC PORTD PORTE PORTF = con-lsta:FE08-1: FEMALE HEADER
PS1 = WALID2008A:MPXAZ6115A: 15 to 115 kPa (2.2 to 16.7 psi) Pressure Sensor INTEGRATED PRESSURE SENSOR 0.2 to 4.8 Volts Output Media Resistant and High Temperature Accuracy Integrated Silicon Pressure Sensor for Measuring Absolute Pressure, On--Chip Signal Conditioned, Temperature Compensated and Calibrated
PS2 = WALID2008A:PS2-CON: YAMAICHI CONNECTOR
PWR = WALID2008A:DC-JACK: FEMALE PRINT CONNECTOR Niedervolt-Steckverbinder Distributor Conrad
Q1 = WALID2008A:CRYSTAL: Crystal
Q2-Q14 Q18 = WALID2008A:BC327: PNP Transistror
Q15 Q16 = WALID2008A:BC337: NPN Transistor
Q17 = transistor-fet:IRF540: N-Channel Enhancement MOSFET (HEXFET); 100V; 28A; 0,077Ohm
R1 R3-R16 R25-R28 = WALID2008A:R-5: Resistor 5, 7,8, 10, 12, 13, 15, 17, 19, 20, 25, 28, 30mm
R2 R17-R24 R31-R72 R80-R99 R102-R106 R108-R113 R115 R117 R119-R159 = WALID2008A:RESISTOR: Resistor 5, 7,8, 10, 12, 13, 15, 17, 19, 20, 25, 28, 30mm
R29 R30 R100 R101 R107 R114 R118 = WALID2008A:POT: Spain Pot Resistor
R116 = ptc-ntc:B57164: SIEMENS NTC
RE1 = WALID2008A:GDRX5-ASK: ASK RECEIVING MODULE TTL Interface GDRX5
RN1-RN5 = resistor-sil:G08R: SIL RESISTOR
RST = WALID2008A:TAC_SW_S: Open Normal Switch
S2-S6 S35 S37 S42 = switch-dil:DIP08YL: DIL/CODE SWITCH
S7 S8 S13 S14 S19 S24 S29 S30 = WALID2008A:10-XX: OMRON SWITCH
S9-S12 S15-S18 S20-S23 S25-S28 = WALID2008A:TAC_SW_B: OMRON SWITCH
S31-S34 S36 S43 = switch-dil:DIP04YL: DIL/CODE SWITCH
S38-S41 = WALID2008A:TAC_SW_M: OMRON SWITCH
S44 = WALID2008A:MMC-SD-CARD: MMC / SD Card Socket
SW1-SW3 = WALID2008A:POWER_SW: SLIDING SWITCH
TR1 = WALID2008A:8050
TR2 = WALID2008A:GDTX6-ASK: ASK TRANSMITTING MODULE GDTX6
U1 = WALID2008A:ATMEGA128_HOLDER
U$1 = WALID2008A:SMARTCARD: ISO 7816 SmartCard and CardSocket
Z1-Z6 = WALID2008A:ZENER: Z DIODE